# EAGLE design TERMINAL v2 (EAGLE 9.6.2)
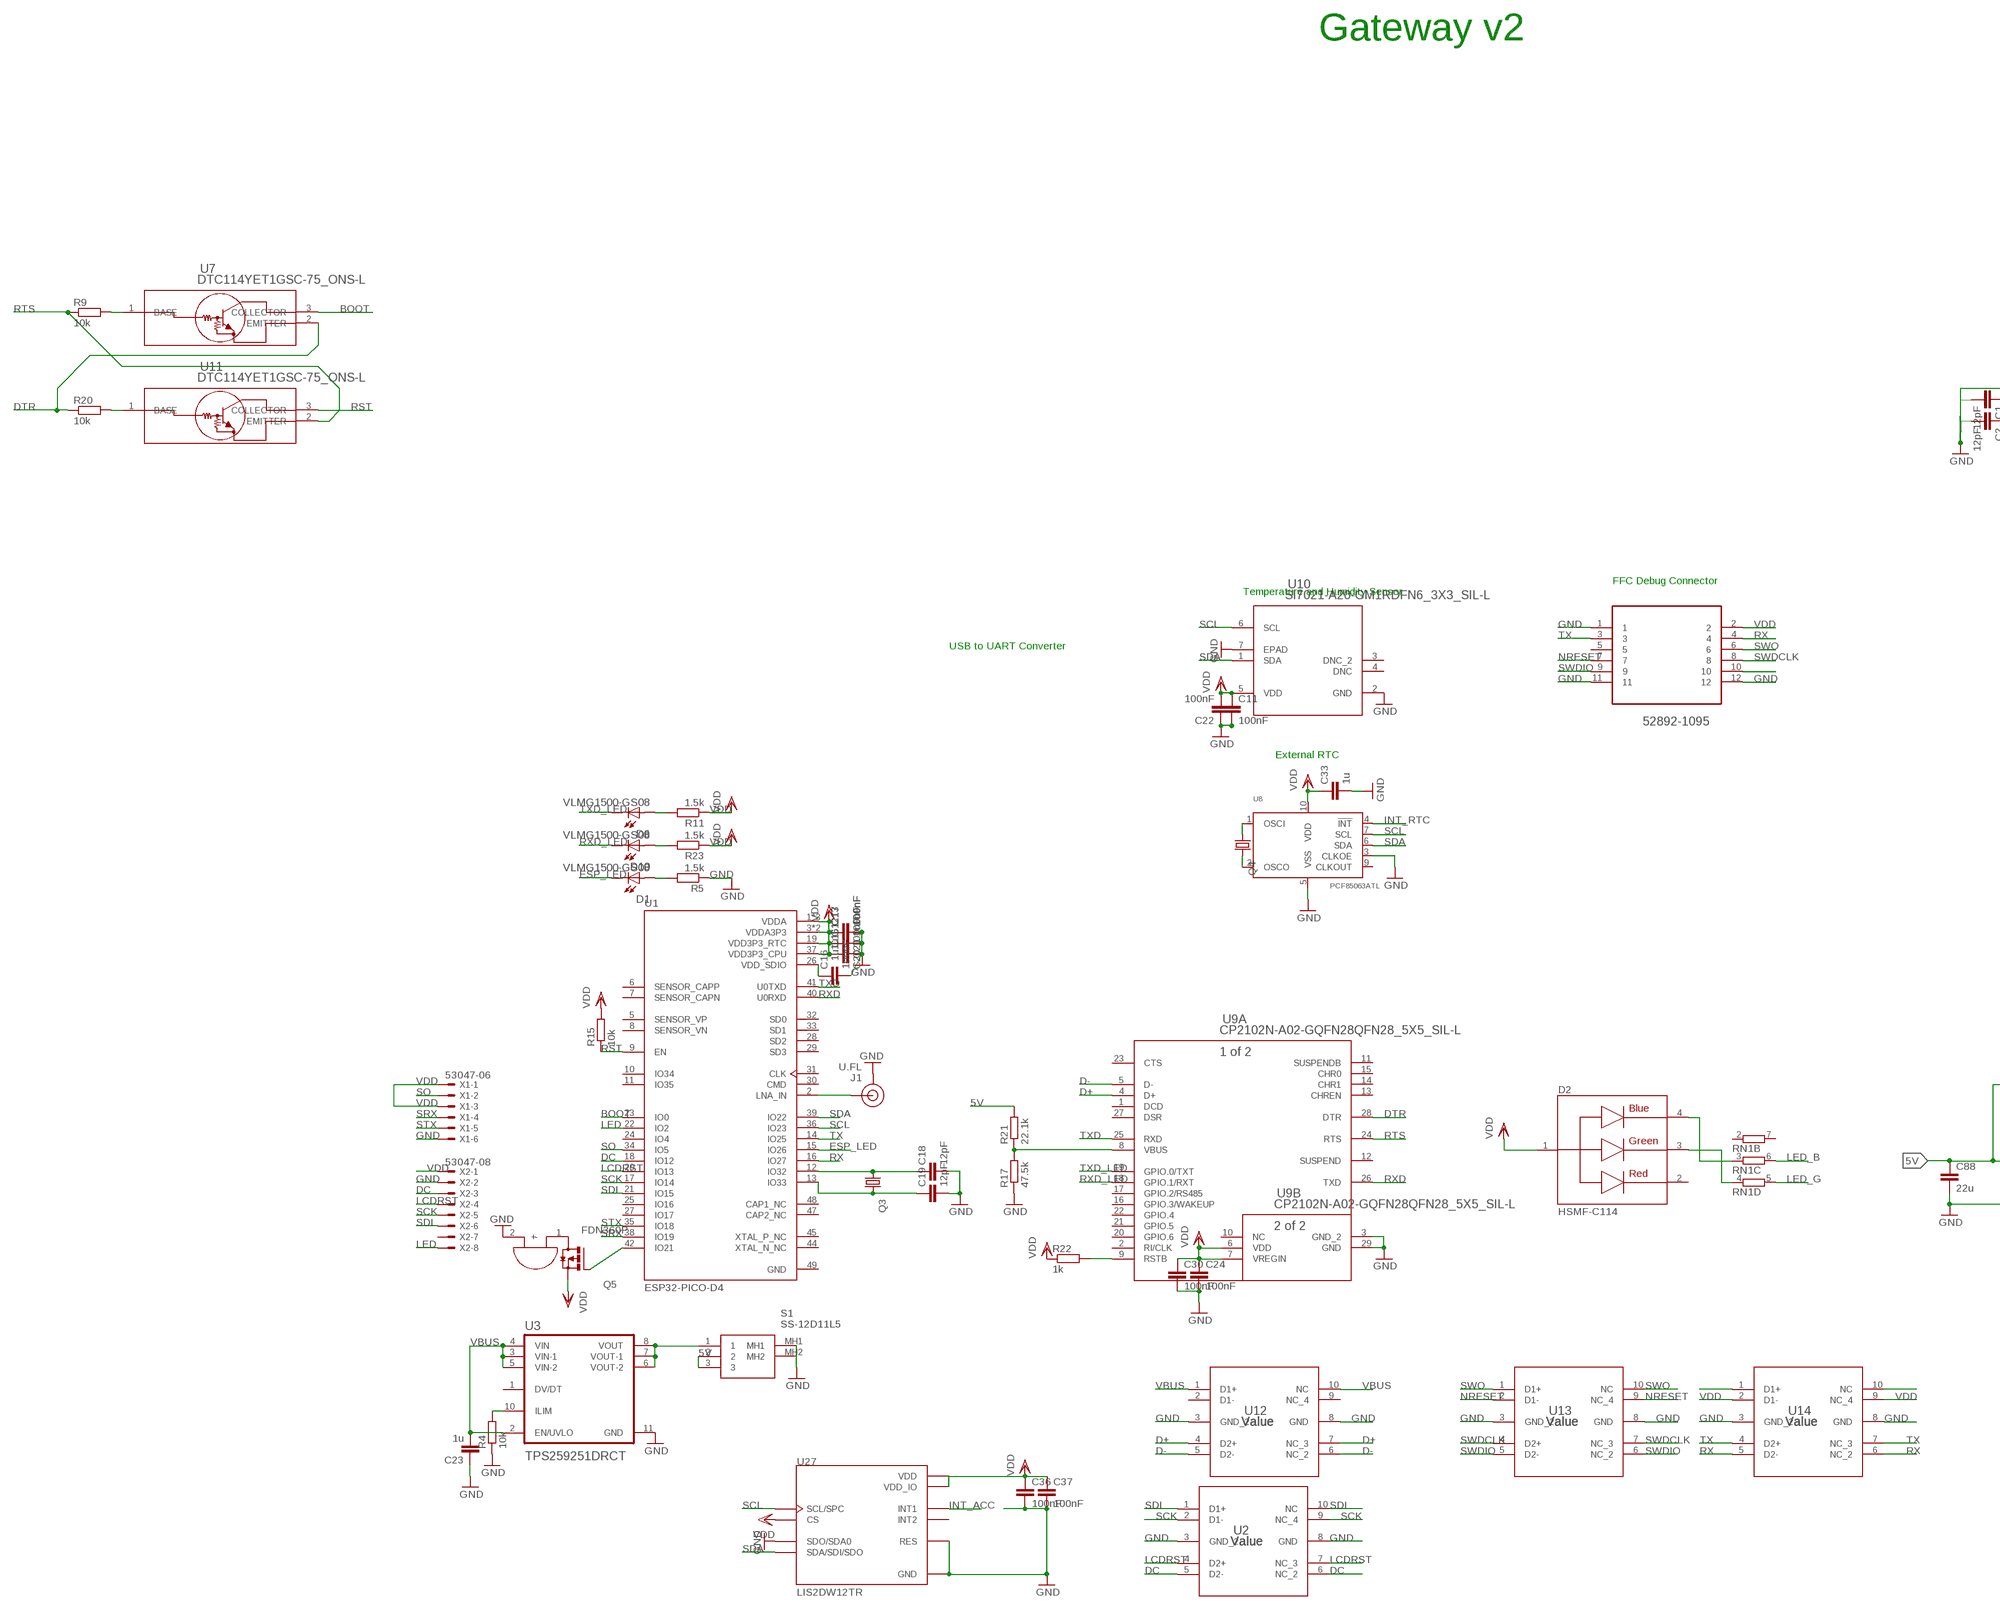
[diagram p0: schematic, sheet 1, part 1 of 2]
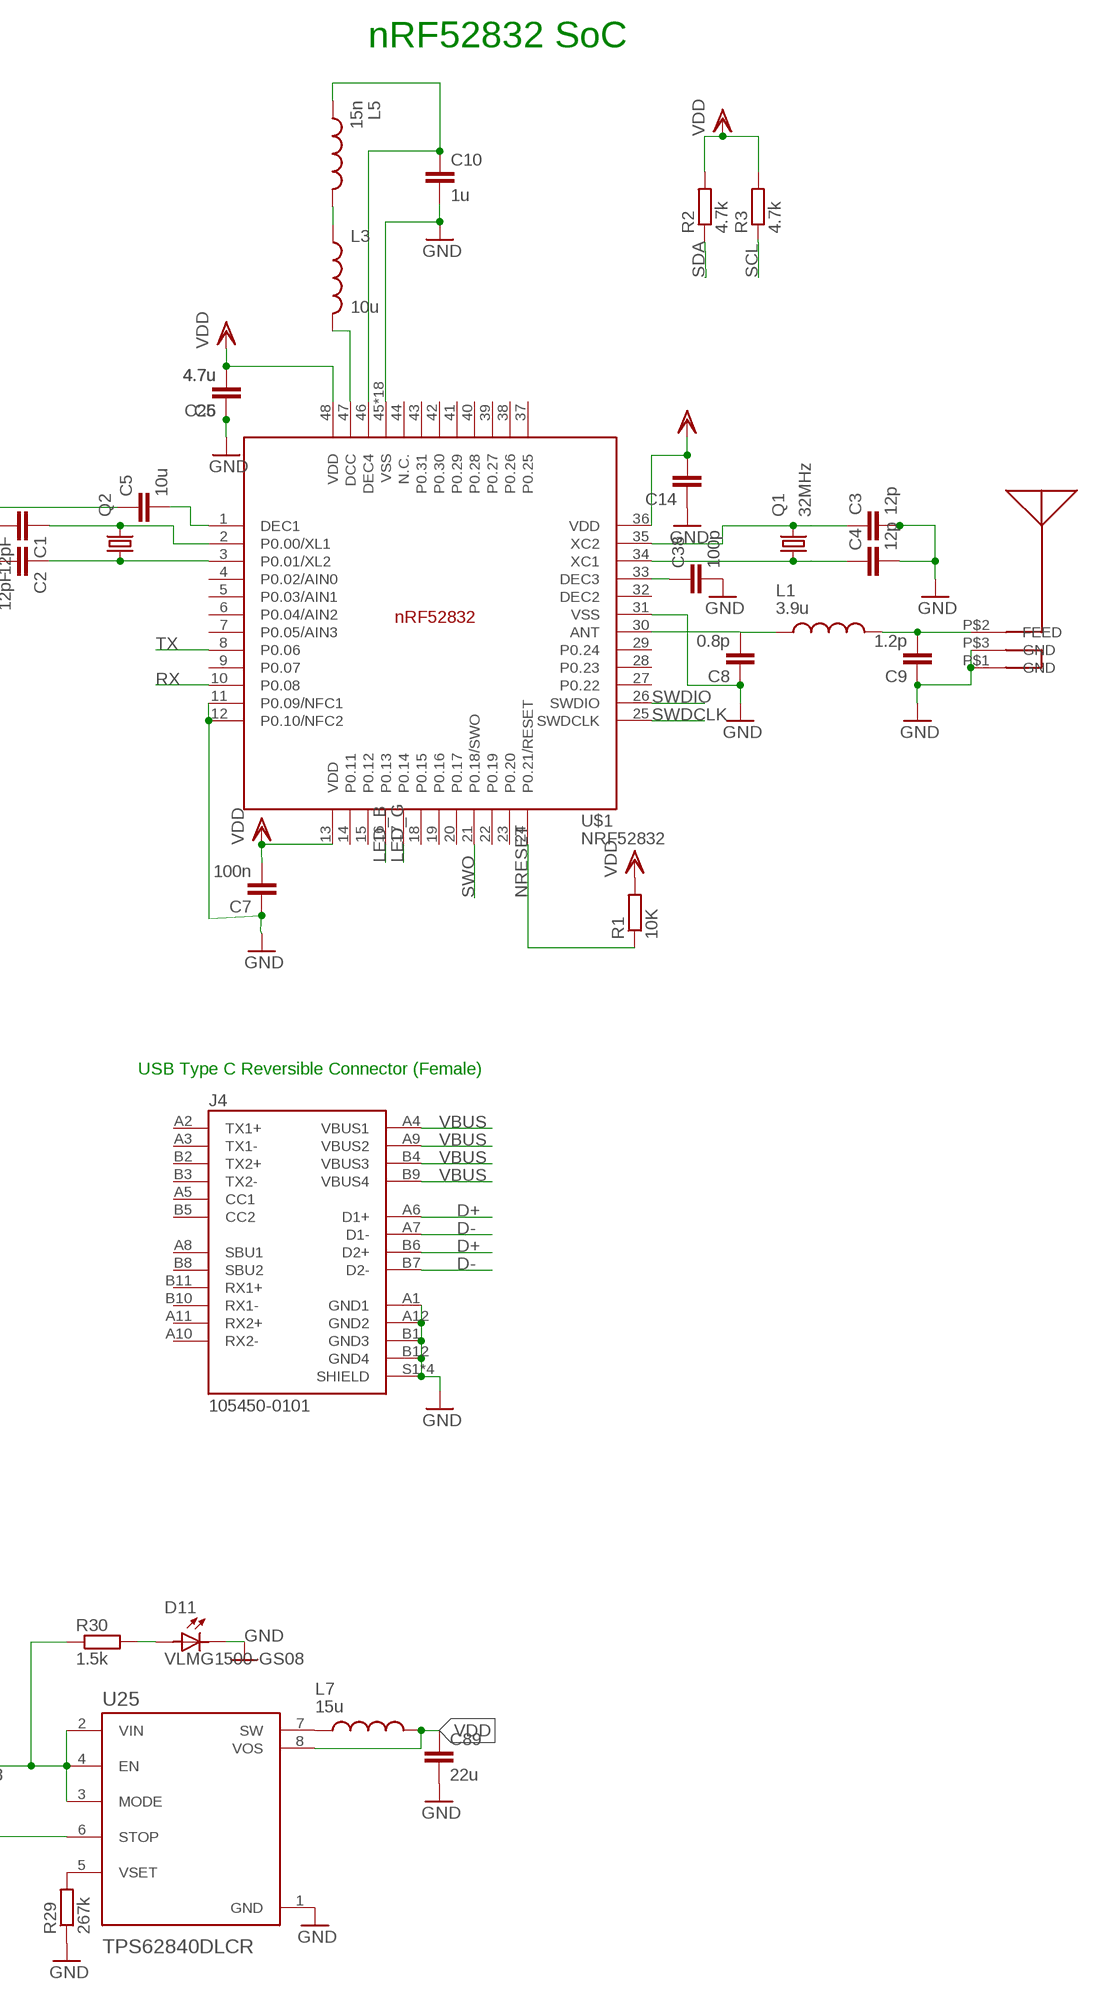
[diagram p1: schematic, sheet 1, part 2 of 2]

## Parts
C1  12pF  CC0402  [C0402]
C2  12pF  CC0402  [C0402]
C3  12p  CC0402  [C0402]
C4  12p  CC0402  [C0402]
C5  10u  CC0402  [C0402]
C6  4.7u  CC0402  [C0402]
C7  100n  CC0402  [C0402]
C8  0.8p  CC0402  [C0402]
C9  1.2p  CC0402  [C0402]
C10  1u  CC0402  [C0402]
C11  100nF  CC0402  [C0402]
C12  100nF  CC0402  [C0402]
C13  100nF  CC0402  [C0402]
C14  100u  CC0402  [C0402]
C15  100nF  CC0402  [C0402]
C16  100nF  CC0402  [C0402]
C17  100nF  CC0402  [C0402]
C18  12pF  CC0402  [C0402]
C19  12pF  CC0402  [C0402]
C20  1u  CC0603R  [C0603R]
C21  1u  CC0603R  [C0603R]
C22  100nF  CC0402  [C0402]
C23  1u  CC0603R  [C0603R]
C24  100nF  CC0402  [C0402]
C25  4.7u  CC0402  [C0402]
C30  100nF  CC0402  [C0402]
C33  1u  CC0603R  [C0603R]
C36  100nF  CC0402  [C0402]
C37  100nF  CC0402  [C0402]
C38  100p  CC0402  [C0402]
C88  22u  CC0603R  [C0603R]
C89  22u  CC0603R  [C0603R]
D1  VLMG1500-GS08  [LEDC1005X35N]
D2  HSMF-C114  [DIOSC160X150X35-4N]
D6  VLMG1500-GS08  [LEDC1005X35N]
D10  VLMG1500-GS08  [LEDC1005X35N]
D11  VLMG1500-GS08  [LEDC1005X35N]
J1  U.FL  U.FL2PIN  [U.FL]
J4  105450-0101  [MOLEX_105450-0101]
L1  3.9u  MHQ0402P7N5JT000  [INDC0402X26N]
L3  10u  INDUCTOR  [L0603]
L5  15n  MHQ0402P7N5JT000  [INDC0402X26N]
L7  15u  1277AS-H-1R5M=P2  [INDC3225X120N]
Q1  32MHz  KX-5  [2.0X1.6_KX-5]
Q2  KX-327-RT  [2.0X1.2]
Q3  KX-327-RT  [2.0X1.2]
Q4  KX-327-RT  [2.0X1.2]
Q5  FDN360P  [SUPER-SOT3]
R1  10K  RR0402  [R0402]
R2  4.7k  RR0402  [R0402]
R3  4.7k  RR0402  [R0402]
R4  10k  RR0402  [R0402]
R5  1.5k  RR0402  [R0402]
R9  10k  RR0402  [R0402]
R11  1.5k  RR0402  [R0402]
R15  10k  RR0402  [R0402]
R17  47.5k  RR0402  [R0402]
R20  10k  RR0402  [R0402]
R21  22.1k  RR0402  [R0402]
R22  1k  RR0402  [R0402]
R23  1.5k  RR0402  [R0402]
R29  267k  RR0402  [R0402]
R30  1.5k  RR0402  [R0402]
RN1  4R-N0402ARV341  [4X0402ARV341]
S1  SS-12D11L5  [SS12D11L5]
U1  ESP32-PICO-D4  [PQFN50P700X700X104-49N]
U2  Value  ESD204DQAR  [DQA0010A]
U3  TPS259251DRCT  [VREG_V62/16624-01YE]
U5  52892-1095  [MOLEX_52892-1095]
U7  DTC114YET1GSC-75_ONS-L  [SC-75_ONS-L]
U8  PCF85063ATL  [SOT1197-1]
U9  CP2102N-A02-GQFN28QFN28_5X5_SIL-L  [QFN28_5X5_SIL-L]
U10  SI7021-A20-GM1RDFN6_3X3_SIL-L  [DFN6_3X3_SIL-L]
U11  DTC114YET1GSC-75_ONS-L  [SC-75_ONS-L]
U12  Value  ESD204DQAR  [DQA0010A]
U13  Value  ESD204DQAR  [DQA0010A]
U14  Value  ESD204DQAR  [DQA0010A]
U25  TPS62840DLCR  [SON50P200X150X100-8N]
U27  LIS2DW12TR  [LGA12R50P4X4_200X200X70]
U$1  NRF52832  [QFN40P600X600X90-48_N]
U$2  SMD_BUZZER  [SMD_BUZZER]
U$4  CHIPANTENNAL2  [CHIPANTENNAL2]
X1  53047-06  [53047-06]
X2  53047-08  [53047-08]

## Nets
5V: C88.1 R21.2 R30.1 S1.2 S1.3 U25.2(VIN) U25.3(MODE) U25.4(EN)
BOOT: U1.23(IO0) U7.3(COLLECTOR)
D+: J4.A6(D1+) J4.B6(D2+) U9.4(A:D+) U12.4(D2+) U12.7(NC_3)
D-: J4.A7(D1-) J4.B7(D2-) U9.5(A:D-) U12.5(D2-) U12.6(NC_2)
DC: U1.18(IO12) U2.5(D2-) U2.6(NC_2) X2.3
DTR: R20.1 U7.2(EMITTER) U9.28(A:DTR)
ESP_LED: D1.2 U1.15(IO26)
GND: C1.2 C2.2 C3.2 C4.2 C5.1 C6.1 C7.1 C8.1 C9.1 C10.2 C11.2 C12.2 C13.2 C14.1 C15.2 C16.2 C17.2 C18.2 C19.2 C20.1 C21.1 C22.1 C23.1 C24.2 C25.1 C30.2 C33.2 C36.2 C37.2 C38.2 C88.2 C89.2 D11.2 J1.1(GND) J1.2(GND) J4.A1(GND1) J4.A12(GND2) J4.B1(GND3) J4.B12(GND4) J4.S1(SHIELD) J4.S2(SHIELD) J4.S3(SHIELD) J4.S4(SHIELD) R4.1 R5.1 R17.1 R29.1 S1.MH1 S1.MH2 U2.3(GND_2) U2.8(GND) U3.11(GND) U5.1 U5.11 U5.12 U8.3(CLKOE) U8.5(VSS) U9.3(B:GND_2) U9.29(B:GND) U10.2(GND) U10.7(EPAD) U12.3(GND_2) U12.8(GND) U13.3(GND_2) U13.8(GND) U14.3(GND_2) U14.8(GND) U25.1(GND) U25.6(STOP) U27.3(SDO/SDA0) U27.6(GND) U27.7(RES) U27.8(GND) U$1.11(P0.09/NFC1) U$1.12(P0.10/NFC2) U$1.31(VSS) U$1.45(VSS) U$1.PAD(VSS) U$1.PAD@VIA01(VSS) U$1.PAD@VIA02(VSS) U$1.PAD@VIA03(VSS) U$1.PAD@VIA04(VSS) U$1.PAD@VIA05(VSS) U$1.PAD@VIA06(VSS) U$1.PAD@VIA07(VSS) U$1.PAD@VIA08(VSS) U$1.PAD@VIA09(VSS) U$1.PAD@VIA10(VSS) U$1.PAD@VIA11(VSS) U$1.PAD@VIA12(VSS) U$1.PAD@VIA13(VSS) U$1.PAD@VIA14(VSS) U$1.PAD@VIA15(VSS) U$1.PAD@VIA16(VSS) U$2.2(-) U$4.P$1(GND) U$4.P$3(GND) X1.6 X2.2
INT_ACC: U27.12(INT1)
INT_RTC: U8.4(!INT!)
LCDRST: U1.20(IO13) U2.4(D2+) U2.7(NC_3) X2.4
LED: U1.22(IO2) X2.8
LED_B: RN1.6 U$1.16(P0.13)
LED_G: RN1.5 U$1.17(P0.14)
N$1: C1.1 Q2.2 U$1.2(P0.00/XL1)
N$2: C2.1 Q2.1 U$1.3(P0.01/XL2)
N$3: C3.1 Q1.3 U$1.35(XC2)
N$4: C4.1 Q1.1 U$1.34(XC1)
N$5: C5.2 U$1.1(DEC1)
N$6: C8.2 L1.1 U$1.30(ANT)
N$7: J1.FEED(SIGNAL) U1.2(LNA_IN)
N$8: C16.1 U1.26(VDD_SDIO)
N$9: L3.2 U$1.47(DCC)
N$10: L3.1 L5.2
N$11: C10.1 L5.1 U$1.46(DEC4)
N$12: C19.1 Q3.2 U1.13(IO33)
N$13: C18.1 Q3.1 U1.12(IO32)
N$14: Q5.3(D) U$2.1(+)
N$15: C38.1 U$1.33(DEC3)
N$16: Q5.1(G) U1.42(IO21)
N$17: S1.1 U3.6(VOUT-2) U3.7(VOUT-1) U3.8(VOUT)
N$18: D1.1 R5.2
N$20: R4.2 U3.10(ILIM)
N$21: U5.10
N$22: D2.3 RN1.4
N$23: R17.2 R21.1 U9.8(A:VBUS)
N$24: D2.4 RN1.3
N$29: R20.2 U11.1(BASE)
N$30: R9.2 U7.1(BASE)
N$33: Q4.1 U8.1(OSCI)
N$34: Q4.2 U8.2(OSCO)
N$35: R22.2 U9.9(A:RSTB)
N$36: D6.1 R11.2
N$37: D10.1 R23.2
N$47: U14.10(NC)
N$80: L7.1 U25.7(SW)
N$81: R29.2 U25.5(VSET)
N$84: D11.1 R30.2
NRESET: R1.1 U5.7 U13.2(D1-) U13.9(NC_4) U$1.24(P0.21/RESET)
RFP1: C9.2 L1.2 U$4.P$2(FEED)
RST: R15.1 U1.9(EN) U11.3(COLLECTOR)
RTS: R9.1 U9.24(A:RTS) U11.2(EMITTER)
RX: U1.16(IO27) U5.4 U14.5(D2-) U14.6(NC_2) U$1.10(P0.08)
RXD: U1.40(U0RXD) U9.26(A:TXD)
RXD_LED: D10.2 U9.18(A:GPIO.1/RXT)
SCK: U1.17(IO14) U2.2(D1-) U2.9(NC_4) X2.5
SCL: R3.1 U1.36(IO23) U8.7(SCL) U10.6(SCL) U27.1(SCL/SPC)
SDA: R2.1 U1.39(IO22) U8.6(SDA) U10.1(SDA) U27.4(SDA/SDI/SDO)
SDI: U1.21(IO15) U2.1(D1+) U2.10(NC) X2.6
SO: U1.34(IO5) X1.2
SRX: U1.38(IO19) X1.4
STX: U1.35(IO18) X1.5
SWDCLK: U5.8 U13.4(D2+) U13.7(NC_3) U$1.25(SWDCLK)
SWDCLK1: U14.1(D1+)
SWDIO: U5.9 U13.5(D2-) U13.6(NC_2) U$1.26(SWDIO)
SWO: U5.6 U13.1(D1+) U13.10(NC) U$1.21(P0.18/SWO)
TX: U1.14(IO25) U5.3 U14.4(D2+) U14.7(NC_3) U$1.8(P0.06)
TXD: U1.41(U0TXD) U9.25(A:RXD)
TXD_LED: D6.2 U9.19(A:GPIO.0/TXT)
VBUS: C23.2 J4.A4(VBUS1) J4.A9(VBUS2) J4.B4(VBUS3) J4.B9(VBUS4) U3.2(EN/UVLO) U3.3(VIN-1) U3.4(VIN) U3.5(VIN-2) U12.1(D1+) U12.10(NC)
VDD: C6.2 C7.2 C11.1 C12.1 C13.1 C14.2 C15.1 C17.1 C20.2 C21.2 C22.2 C24.1 C25.2 C30.1 C33.1 C36.1 C37.1 C89.1 D2.1 L7.2 Q5.2(S) R1.2 R2.2 R3.2 R11.1 R15.2 R22.1 R23.1 U1.1(VDDA) U1.3(VDDA3P3) U1.4(VDDA3P3) U1.19(VDD3P3_RTC) U1.37(VDD3P3_CPU) U1.43(VDDA) U1.46(VDDA) U5.2 U8.10(VDD) U9.6(B:VDD) U9.7(B:VREGIN) U10.5(VDD) U14.2(D1-) U14.9(NC_4) U25.8(VOS) U27.2(CS) U27.9(VDD) U27.10(VDD_IO) U$1.13(VDD) U$1.36(VDD) U$1.48(VDD) X1.1 X1.3 X2.1
Unconnected: D2.2 J4.A2(TX1+) J4.A3(TX1-) J4.A5(CC1) J4.A8(SBU1) J4.A10(RX2-) J4.A11(RX2+) J4.B2(TX2+) J4.B3(TX2-) J4.B5(CC2) J4.B8(SBU2) J4.B10(RX1-) J4.B11(RX1+) RN1.1 RN1.2 RN1.7 RN1.8 U1.5(SENSOR_VP) U1.6(SENSOR_CAPP) U1.7(SENSOR_CAPN) U1.8(SENSOR_VN) U1.10(IO34) U1.11(IO35) U1.24(IO4) U1.25(IO16) U1.27(IO17) U1.28(SD2) U1.29(SD3) U1.30(CMD) U1.31(CLK) U1.32(SD0) U1.33(SD1) U1.44(XTAL_N_NC) U1.45(XTAL_P_NC) U1.47(CAP2_NC) U1.48(CAP1_NC) U3.1(DV/DT) U5.5 U8.9(CLKOUT) U9.1(A:DCD) U9.2(A:RI/CLK) U9.10(B:NC) U9.11(A:SUSPENDB) U9.12(A:SUSPEND) U9.13(A:CHREN) U9.14(A:CHR1) U9.15(A:CHR0) U9.16(A:GPIO.3/WAKEUP) U9.17(A:GPIO.2/RS485) U9.20(A:GPIO.6) U9.21(A:GPIO.5) U9.22(A:GPIO.4) U9.23(A:CTS) U9.27(A:DSR) U10.3(DNC_2) U10.4(DNC) U12.2(D1-) U12.9(NC_4) U27.11(INT2) U$1.4(P0.02/AIN0) U$1.5(P0.03/AIN1) U$1.6(P0.04/AIN2) U$1.7(P0.05/AIN3) U$1.9(P0.07) U$1.14(P0.11) U$1.15(P0.12) U$1.18(P0.15) U$1.19(P0.16) U$1.20(P0.17) U$1.22(P0.19) U$1.23(P0.20) U$1.27(P0.22) U$1.28(P0.23) U$1.29(P0.24) U$1.32(DEC2) U$1.37(P0.25) U$1.38(P0.26) U$1.39(P0.27) U$1.40(P0.28) U$1.41(P0.29) U$1.42(P0.30) U$1.43(P0.31) U$1.44(N.C.) X2.7

## Notes on the sheet
- Gateway v2
- nRF52832 SoC
- FFC Debug Connector
- Temperature and Humidity Sensor
- USB to UART Converter
- USB Type C Reversible Connector (Female)
- External RTC

## Power pins joined to a net without a drawn wire
GND: U1.49(GND)

## Library data of the parts
C1-C19 C22 C24 C25 C30 C36-C38 = eagle-ltspice:C: CAPACITOR, European symbol; SPICEMODEL: NONE; SPICEPREFIX: C
C20 C21 C23 C33 C88 C89 = eagle-ltspice:C: CAPACITOR, European symbol
D1 D6 D10 D11 = VLMG1500-GS08:VLMG1500-GS08: 0402 GREEN 571nm 35MCD 65° Rectangle with Flat Top SMT LED; AVAILABILITY: Unavailable; DESCRIPTION: 0402 GREEN 571nm 35MCD 65° Rectangle with Flat Top SMT LED; MF: Vishay; MP: VLMG1500-GS08; PACKAGE: 0402 Vishay; PRICE: None
D2 = HSMF-C114:HSMF-C114: LED Tri-Color Blue/Green/Red 468nm/523nm/637nm 4-Pin Chip LED T/R; AVAILABILITY: Unavailable; DESCRIPTION: LED RGB DIFFUSED CHIP SMD; MF: Broadcom Limited; MP: HSMF-C114; PACKAGE: 0606 Broadcom; PRICE: None
J1 = SparkFun-Connectors:U.FL2PIN: SMD Antenna Connector - U.FL 2mm height, 3.0mm x 3.0mm receptacle size. SparkFun Products: SparkFun WiFi Shield - ESP8266 <https://www.sparkfun.com/products/13287> SparkFun ESP8266 Thing <https://www.sparkfun.com/products/13231> SparkFun MiniGen - Pro Mini Signal Generator Shield <https://www.sparkfun.com/products/11420>; PROD_ID: CONN-09193; SF_ID: WRL-09144
J4 = 105450-0101:105450-0101: USB Shielded I/O Receptacle; Type C; Right Angle; Surface Mount; Gold over Nickel; AVAILABILITY: Unavailable; DESCRIPTION: USB-C (USB TYPE-C) USB 3.1 (USB 3.1 Gen 2, Superspeed+) Receptacle Connector 24 Position Surface Mount, Right Angle; Through Hole; MF: Molex; MP: 1054500101; PACKAGE: None; PRICE: None
L1 L5 = MHQ0402P7N5JT000:MHQ0402P7N5JT000: 221 NH 5% GOLD TERMINAL; AVAILABILITY: Unavailable; DESCRIPTION: FIXED IND 7.5NH 200MA 1.2 OHM; MF: TDK; MP: MHQ0402P7N5JT000; PACKAGE: 0402 TDK; PRICE: None
L3 = BeagleBone_Blue_R3:INDUCTOR: Inductors Basic Inductor/Choke - 0603 and 1206. Footprints are not proven and vary greatly between part numbers. SRN6045- 33uH, 20% 1.4A
L7 = 1277AS-H-1R5M_P2:1277AS-H-1R5M=P2: Ind Metal Alloy Shielded 1.5uH 20% 1MHz Powdered Iron 2.6A 1210 T/R Check prices <https://pricing.snapeda.com/parts/1277AS-H-1R5M%3DP2/Murata/view-part?ref=eda>; AVAILABILITY: Warning; DESCRIPTION: Inductor with Inductance: 1.5uH Tol. +/-20%, Package: 1210 (3225); MF: Murata; MP: 1277AS-H-1R5M=P2; PACKAGE: 1210 Murata; PRICE: None; PURCHASE-URL: https://pricing.snapeda.com/search/part/1277AS-H-1R5M=P2/?ref=eda
Q1 = crystal-geyer_V1_0:KX: Quartz Crystals (MHz) SMD: KX - Serie Model Size l/w/h [mm] Frequency Range Frequency Stability Temp. Range [°C] Load Capacitance AECQ 200 availabel Datasheet KX-4 KX-5 KX-6 KX-7 KX-9A KX-9B KX-12A KX-12B KX-13 KX-20 KX-K KX-KS 1.6/1.2/0.3 2.0/1.6/0.45 2.5/2.0/0.55 3.2/2.5/0.8 5.0/3.2/1.0 5.0/3.2/1.1 6.0/3.5/1.1 6.0/3.5/1.0 7.0/5.0 /1.3 11.6/5.5/1.6 12.3/4.5/4.2 12.3/4.5/3.2 24.0 ~ 80.0 MHz 16.0 ~ 80.0 MHz 12.0 ~ 80.0 MHz 8.0 ~ 60.0 MHz 7,68 ~ 300,0 MHz 8,0 ~ 50,0 MHz 8,0 ~ 150,0 MHz 8,0 ~ 50,0 MHz 6,0 ~ 160,0 MHz 3,579 ~ 25,0 MHz 3,579 ~ 70,0 MHz 3,579 ~ 70,0 MHz ±10 … ±50ppm ±10 … ±50ppm ±10 … ±50ppm ±10 … ±50ppm ±10 … ±50ppm ±10 … ±50ppm ±10 … ±50ppm ±10 … ±50ppm ±10 … ±50ppm ±50ppm ±10 … ±50ppm ±10 … ±50ppm (*) -40°C …+85°C (*) -40°C …+125°C (*) -40°C …+125°C (*) -40°C …+125°C (*) -40°C …+105°C (*) -40°C …+105°C (*) -40°C …+125°C (*) -40°C …+105°C (*) -40°C …+105°C (*) -40°C …+105°C (*) -40°C …+85°C (*) -40°C …+85°C 8, 8…16 8, 8…16 10, 8…16 12, 7…20 16, 10…20 16, 10…20 16, 10…20 16, 12…20 16, 12…20 16, 12…20 16, 12…30 16, 12…30 - yes yes yes - - - - - - - - KX-4.pdf <http://www.geyer-electronic.de/uploads/tx_userartikelfrequenz/GEYER-KX-4.pdf> KX-5.pdf <http://www.geyer-electronic.de/uploads/tx_userartikelfrequenz/GEYER-KX-5.pdf> KX-6.pdf <http://www.geyer-electronic.de/uploads/tx_userartikelfrequenz/GEYER-KX-6.pdf> KX-7.pdf <http://www.geyer-electronic.de/uploads/tx_userartikelfrequenz/GEYER-KX-7.pdf> KX-9A.pdf <http://www.geyer-electronic.de/uploads/tx_userartikelfrequenz/GEYER-KX-9A.pdf> KX-9B.pdf <http://www.geyer-electronic.de/uploads/tx_userartikelfrequenz/GEYER-KX-9B.pdf> KX-12A.pdf <http://www.geyer-electronic.de/uploads/tx_userartikelfrequenz/GEYER-KX-12A.pdf> KX-12B.pdf <http://www.geyer-electronic.de/uploads/tx_userartikelfrequenz/GEYER-KX-12B.pdf> KX-13.pdf <http://www.geyer-electronic.de/uploads/tx_userartikelfrequenz/GEYER-KX-13.pdf> KX-20.pdf <http://www.geyer-electronic.de/uploads/tx_userartikelfrequenz/GEYER-KX-20.pdf> KX-K.pdf <http://www.geyer-electronic.de/uploads/tx_userartikelfrequenz/GEYER-KX-K.pdf> KX-KS.pdf <http://www.geyer-electronic.de/uploads/tx_userartikelfrequenz/GEYER-KX-KS.pdf> <http://www.geyer-electronic.de/fileadmin/template/img/logo-geyer-electronic.png> Details see: http://www.geyer-electronic.de/Frequenz-Produkte.9.0.html Created 2016-06-07, Hans Locher 2016 (C) Geyer Quartz Technology KX4,KX5,KX6,KX7,KX9A,KX9B,KX12A,KX12B,KX13,KX20,KXK,KXKS;1612;2016;2520;3225;5032;6035;7050;11655;12345;1,6x1,2;2,0x1,6;2,5x2,0;3,2x2,5;5,0x3,2;6,0x3,5;7,0x5,0;11,6x5,5;12,3x4,5;12,3x4,5;1.6x1.2;2.0x1.6;2.5x2.0;3.2x2.5;5.0x3.2;6.0x3.5;7.0x5.0;11.6x5.5;12.3x4.5;12.3x4.5;
Q2-Q4 = crystal-geyer_V1_0:KX-327: Tuning Fork Crystals (kHz) SMD: KX327 - Serie Model Size l/w/h [mm] Frequency Range Frequency Stability Temp. Range [°C] Load Capacitance AECQ 200 availabel Datasheet KX-327VT KX-327FT KX-327RT KX-327NHT KX-327NHF KX-327L KX-327S 1.25/1.05/0.5 1.6/1.0/0.5 2.0/1.2/0.6 3.2/1.5/0.8 3.2/1.5/0.8 7.0/1.5/1.4 8.2/3.8/2.5 32,768 kHz 32,768 kHz 32,768 kHz 32,768 kHz 32,768 kHz 32,768 kHz 32,768 kHz ±10 … ±20ppm ±10 … ±20ppm ±10 … ±20ppm ±10 … ±20ppm ±10 … ±20ppm ±10 … ±20ppm ±5 … ±20ppm (*) -40°C …+85°C (*) -40°C …+85°C (*) -40°C …+85°C (*) -40°C …+85°C (*) -40°C …+125°C (*) -40°C …+85°C (*) -40°C …+85°C 7/9/12,5 7/9/12,5 7/9/12,6 7/9/12,5 9/12,5 7/9/12,5 6/12,5 - - - - yes - - KX-327VT.pdf <http://www.geyer-electronic.de/uploads/tx_userartikelfrequenz/GEYER-KX-327VT.pdf> KX-327FT.pdf <http://www.geyer-electronic.de/uploads/tx_userartikelfrequenz/GEYER-KX-327FT.pdf> KX-327RT.pdf <http://www.geyer-electronic.de/uploads/tx_userartikelfrequenz/GEYER-KX-327RT.pdf> KX-327NHT.pdf <http://www.geyer-electronic.de/uploads/tx_userartikelfrequenz/GEYER-KX-327NHT.pdf> KX-327NHF.pdf <http://www.geyer-electronic.de/uploads/tx_userartikelfrequenz/GEYER-KX-327NHF.pdf> KX-327L.pdf <http://www.geyer-electronic.de/uploads/tx_userartikelfrequenz/GEYER-KX-327L.pdf> KX-327S.pdf <http://www.geyer-electronic.de/uploads/tx_userartikelfrequenz/GEYER-KX-327S.pdf> <http://www.geyer-electronic.de/fileadmin/template/img/logo-geyer-electronic.png> Details see: http://www.geyer-electronic.de/Frequenz-Produkte.9.0.html Created 2016-06-07, Hans Locher 2016 (C) Geyer Quartz Technology KX327VT,KX327FT,KX327RT,KX327NHT,KX327NHF,KX327S,KX327L;125105;1610;2012;3215;7015;8238;1,25x1,05,1.25x1.05;1,6x1,0,1.6x1.0;2,0x1,2,2.0x1.2;3,2x1,5,3.2x1.5;8,2x3,8,8.2x3.8,7.0x1.5,7,0x1,532.768kHz
Q5 = transistor-power:FDN360P: Single P-Channel, PowerTrench (R) MOSFET Source: http://www.fairchildsemi.com/ds/FD/FDN360P.pdf
R1-R5 R9 R11 R15 R17 R20-R23 R29 R30 = eagle-ltspice:R: RESISTOR, European symbol; SPICEMODEL: NONE; SPICEPREFIX: R
RN1 = resistor-dil:4R-N: Array Chip Resistor Source: RS Component / Phycomp; OC_FARNELL: unknown; OC_NEWARK: unknown
S1 = SS-12D11L5:SS-12D11L5: Toggle Switches DIP RoHS Source: Datasheet <https://datasheet.lcsc.com/szlcsc/XKB-SS-12D11L5_C319010.pdf>; ARROW_PART_NUMBER: SS-12D11L5; DESCRIPTION: Toggle Switches DIP RoHS; HEIGHT: 6.9mm; MANUFACTURER_NAME: XKB Enterprise; MANUFACTURER_PART_NUMBER: SS-12D11L5
U1 = ESP32-PICO-D4:ESP32-PICO-D4: Bluetooth, WiFi 802.11b/g/n, Bluetooth v4.2 +EDR, Class 1, 2 and 3 Transceiver Module 2.4GHz ~ 2.5GHz Surface Mount Check prices <https://pricing.snapeda.com/parts/ESP32-PICO-D4/Espressif%20Systems/view-part?ref=eda>; AVAILABILITY: In Stock; DESCRIPTION: Bluetooth, WiFi 802.11b/g/n, Bluetooth v4.2 +EDR, Class 1, 2 and 3 Transceiver Module 2.4GHz ~ 2.5GHz Surface Mount; MF: Espressif Systems; MP: ESP32-PICO-D4; PACKAGE: SMD-48 Espressif Systems; PRICE: None
U2 U12-U14 = ESD204DQAR:ESD204DQAR; MANUFACTURER: Texas Instruments; PARTNUMBER: ESD204DQAR; REFDES: RefDes; TYPE: TYPE
U3 = TPS259251DRCT:TPS259251DRCT: Check prices <https://pricing.snapeda.com/parts/TPS259251DRCT/Texas%20Instruments/view-part?ref=eda>; AVAILABILITY: Warning; DESCRIPTION: 4.5-V-5.5-V, 30m?, 2-5A eFuse 10-VSON -40 to 85; MF: Texas Instruments; MP: TPS259251DRCT; PACKAGE: VSON-10 Texas Instruments; PRICE: None; PURCHASE-URL: https://pricing.snapeda.com/search/part/TPS259251DRCT/?ref=eda
U5 = 52892-1095:52892-1095: CONNECTOR, FPC, ZIF, 0.50MM, 10 WAY; AVAILABILITY: Unavailable; DESCRIPTION: Socket, r/a, Fpc, Zif, Smt, 10way; MF: Molex; MP: 52892-1095; PACKAGE: None; PRICE: None
U7 U11 = DTC114YET1G:DTC114YET1G; BUILT_BY: EMA_Justin; COPYRIGHT: Copyright (C) 2018 Accelerated Designs. All rights reserved; DATASHEET: https://www.onsemi.com/pub/Collateral/DTC114Y-D.PDF; MANUFACTURER_PART_NUMBER: DTC114YET1G; SOURCELIBRARY: ON_Semiconductor_2020-01-13; VENDOR: ON Semiconductor
U8 = PCF85063ATL:PCF85063ATL: Tiny Real-Time Clock/calendar with alarm function and I2C-bus The PCF85063A is a CMOS1 Real-Time Clock (RTC) and calendar optimized for low power consumption. An offset register allows fine-tuning of the clock. All addresses and data are transferred serially via the two-line bidirectional I2C-bus. Maximum data rate is 400 kbit/s. The register address is incremented automatically after each written or read data byte. AAL Eindhoven MK; AVAILABILITY: Unavailable; DESCRIPTION: Real Time Clock _RTC_ IC Clock/Calendar I²C, 2-Wire Serial 10-XFDFN Exposed Pad; MF: NXP USA; MP: PCF85063ATL; PACKAGE: DFN-10 NXP Semiconductors; PRICE: None
U9 = CP2102N:CP2102N-A02-GQFN28; BUILT_BY: EMA_Cory; COPYRIGHT: Copyright (C) 2018 Accelerated Designs. All rights reserved; DATASHEET: https://www.silabs.com/documents/public/data-sheets/cp2102n-datasheet.pdf; MANUFACTURER_PART_NUMBER: CP2102N-A02-GQFN28; SOURCELIBRARY: Silicon_Labs_2020-02-14; VENDOR: Silicon Labs
U10 = SI7021:SI7021-A20-GM1R; BUILT_BY: EMA_Jessica; COPYRIGHT: Copyright (C) 2018 Accelerated Designs. All rights reserved; MANUFACTURER_PART_NUMBER: SI7021-A20-GM1R; SOURCELIBRARY: Silicon_Labs_2020-01-01; VENDOR: Silicon Labs
U25 = TPS62840DLCR:TPS62840DLCR: None Check prices <https://snapeda.com/parts/TPS62840DLCR/Texas%20Instruments/view-part/?ref=eda> Check prices <https://pricing.snapeda.com/parts/TPS62840DLCR/Texas%20Instruments/view-part?ref=eda>; AVAILABILITY: Warning; DESCRIPTION: 60-nA IQ, 1.8-V to 6.5-VIN, high-efficiency 750-mA step-down converter 8-VSON-HR -40 to 125; MF: Texas Instruments; MP: TPS62840DLCR; PACKAGE: VSON-HR-8 Texas Instruments; PRICE: None; PURCHASE-URL: https://pricing.snapeda.com/search/part/TPS62840DLCR/?ref=eda
U27 = LIS2DW12TR:LIS2DW12TR: Mems Digital Output Motion Sensor Check prices <https://pricing.snapeda.com/parts/LIS2DW12TR/STMicroelectronics/view-part?ref=eda>; AVAILABILITY: Good; DESCRIPTION: Accelerometer X, Y, Z Axis ±2g, 4g, 8g, 16g 400Hz 12-LGA (2x2); MF: STMicroelectronics; MP: LIS2DW12TR; PACKAGE: LGA-12 STMicroelectronics; PRICE: None; PURCHASE-URL: https://pricing.snapeda.com/search/part/LIS2DW12TR/?ref=eda
U$1 = Nordic_nRF:NRF52832: nRF52832 Features Single chip, highly flexible, 2.4 GHz multi-protocol SoC 32-bit ARM Cortex-M4F Processor 1.7v to 3.6v operation 512kB flash + 64kB RAM Supports concurrent Bluetooth Smart/ANT protocol operation On-chip NFC tag for Out-of-Band (OOB) pairing Up to +4dBm output power -96dBm sensitivity, Bluetooth Smart Thread safe and run-time protected Event driven API On air compatible with nRF24L and nRF24AP series 2 data rates (2Mbps/1Mbps) PPI - maximum flexibility for power-efficient applications and code simplification Automated power management system with automatic power management of each peripheral Configurable I/O mapping for analog and digital I/O 3 x Master/Slave SPI 2 x Two-wire interface (I²C) UART (RTS/CTS) 3 x PWM AES HW encryption Real Time Counter (RTC) Digital microphone interface (PDM) On-chip balun Applications Internet of Things (IoT) Wearables SmartHome sensors Connected white goods Computer peripherals Voice-command smart remotes A4WP ‘Rezence’ wireless charging Beacons Sports and fitness sensors and hubs Connected health products Smart watches RC Toys Interactive games Building automation and sensor networks
U$2 = SMD_BUZZER:SMD_BUZZER
U$4 = CHIPANTENNA:CHIPANTENNAL2
X1 = con-molex:53?-06: CONNECTOR wire to board 1.25 mm (.049 inch) pitch header; MF: MOLEX; MPN: 53047-0610-C; OC_FARNELL: 9733078; OC_NEWARK: 03M2965
X2 = con-molex:53?-08: CONNECTOR wire to board 1.25 mm (.049 inch) pitch header; MF: MOLEX; MPN: 53047-0810; OC_FARNELL: 1012258; OC_NEWARK: 98K9826

## Board
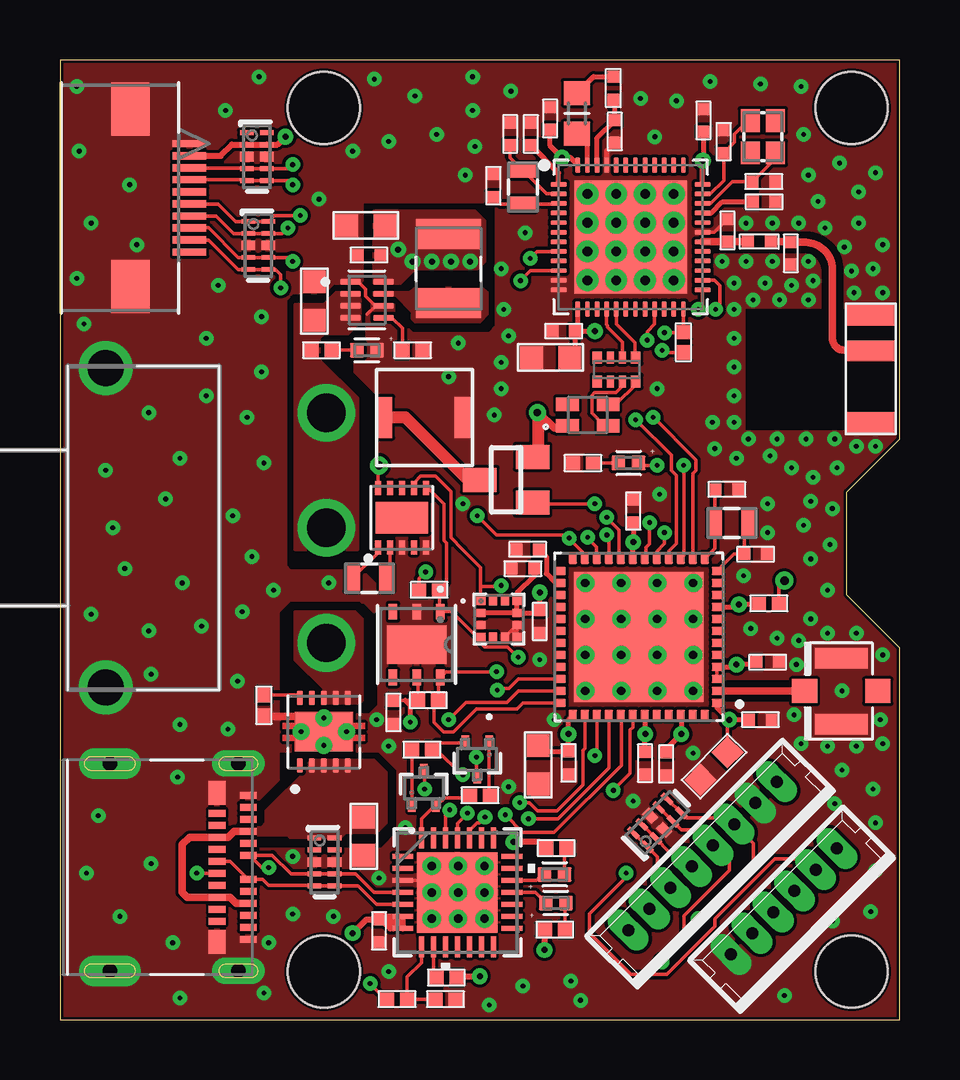
[diagram p2: board, top side]
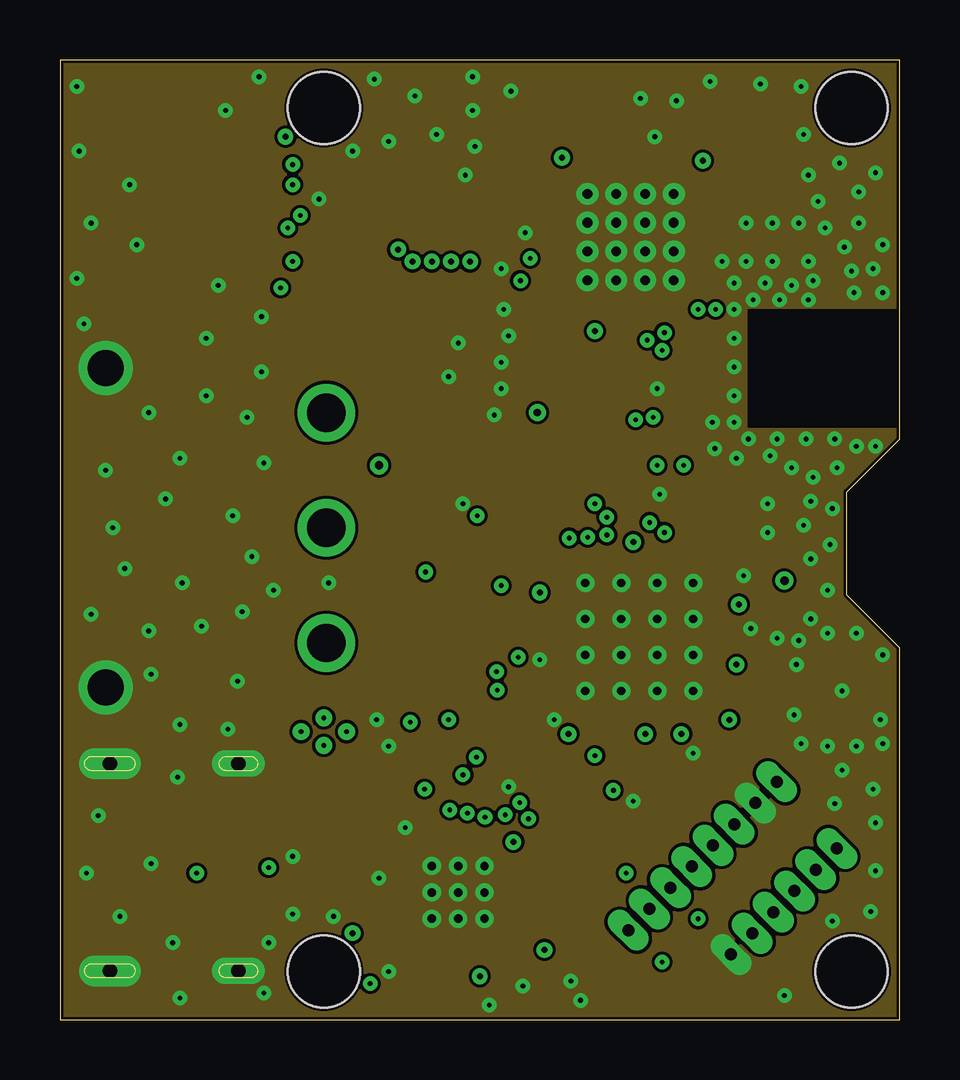
[diagram p3: board, inner layer Route2]
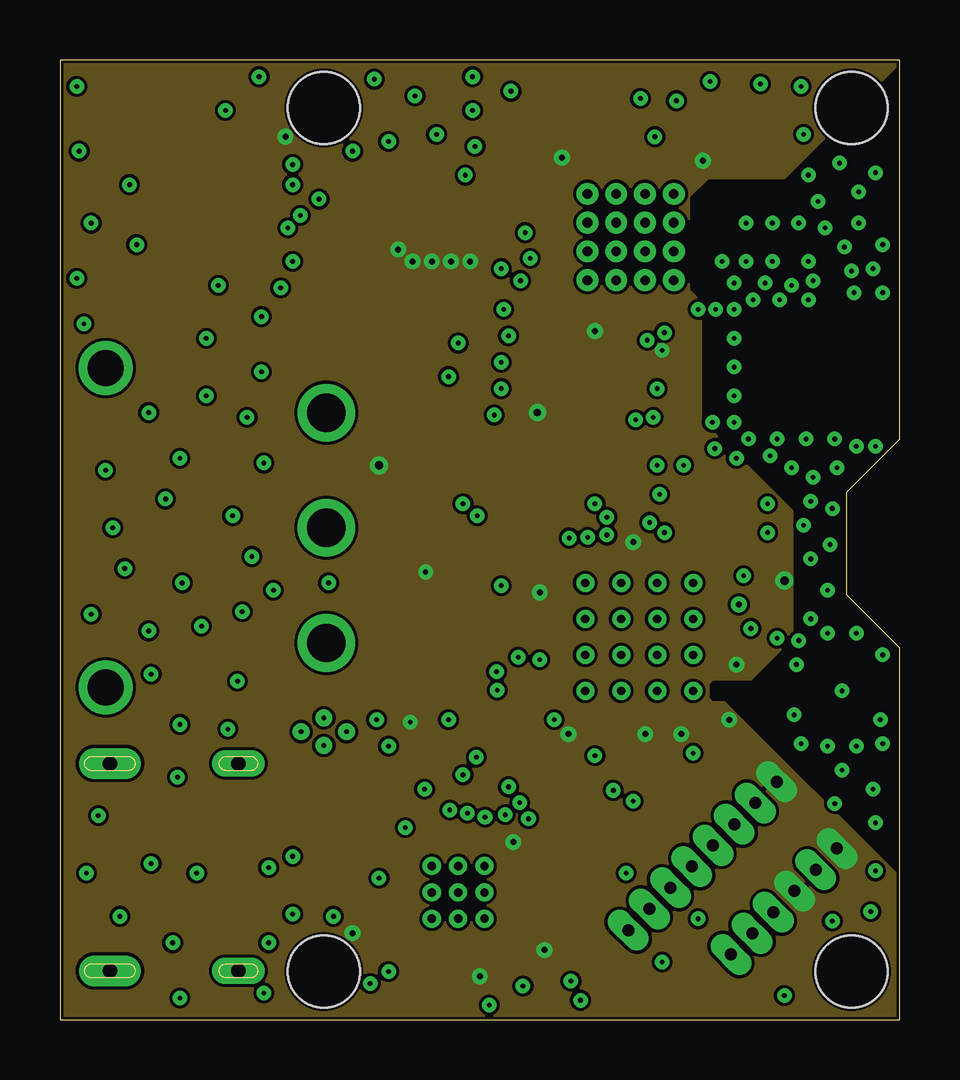
[diagram p4: board, inner layer Route15]
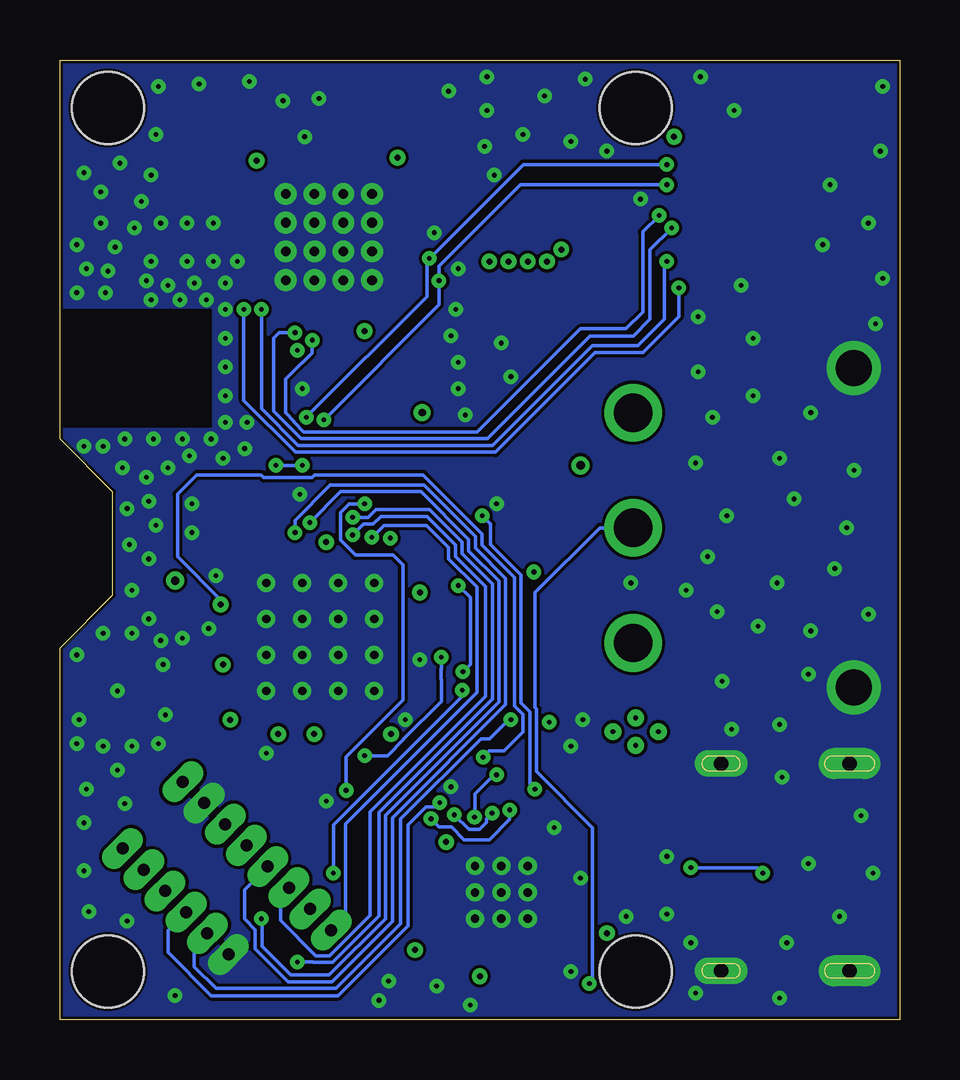
[diagram p5: board, bottom side, seen from below]

Size 35 x 40 mm. Coordinates in mm from the lower left corner, seen from the top.
Outline: 0,0 35,0 35,15.5 32.8,17.7 32.8,22 35,24.2 35,40 0,40 0,0
Copper layers (1+2*15+16): Top 0.035mm / dielectric 1.5mm / Route2 0.035mm / dielectric 0.15mm / Route15 0.035mm / dielectric 0.2mm / Bottom 0.035mm
Design rules "default *": minimum track width 5mil, minimum drill 0.2mm, track to track 5mil, track to pad 5mil, pad to pad 5mil, via to via 5mil, smd to smd 5mil, copper to edge 5mil, drill to drill 6mil, minimum pad ring 10mil, minimum via ring 8mil, stop-mask expansion 0mil, vias tented up to drill 40mil, thermal gap 0mil
Holes 3 mm at 33,2 33,38 11,38 11,2
tRestrict: 10 lines

### Footprints (pad centres in the part's own frame; a part is rotated, then mirrored left to right if it is on the bottom)
C0402 = smd 0.5 x 0.5: 1 -0.475,0; 2 0.475,0
C0603R = smd 0.95 x 0.95: 1 -0.85,0; 2 0.75,0
LEDC1005X35N = smd 0.59 x 0.61: 1 -0.415,0; 2 0.415,0
DIOSC160X150X35-4N = smd 0.94 x 0.57: 1 -0.845,-0.45; 2 -0.845,0.45; 3 0.845,0.45; 4 0.845,-0.45
U.FL = smd 2.2 x 0.85: 1 0,1.375; 2 0,-1.375 | smd 1.05 x 1: FEED 1.525,0; NC -1.525,0
MOLEX_105450-0101 = smd 0.3 x 0.7: A1 -3,3.77; A2 -2.5,3.77; A3 -2,3.77; A4 -1.5,3.77; A5 -1,3.77; A6 -0.5,3.77; A7 0.5,3.77; A8 1,3.77; A9 1.5,3.77; A10 2,3.77; A11 2.5,3.77; A12 3,3.77; B2 2.25,2.47; B3 1.75,2.47; B4 1.25,2.47; B5 0.75,2.47; B6 0.25,2.47; B7 -0.25,2.47; B8 -0.75,2.47; B9 -1.25,2.47; B10 -1.75,2.47; B11 -2.25,2.47 | smd 1 x 0.7: B1 3.1,2.47; B12 -3.1,2.47 | drill 0.6 pad 1.1 long: S1 -4.32,3.36; S2 4.32,3.36 | drill 0.6 pad 1.3 long: S3 -4.32,-2; S4 4.32,-2
INDC0402X26N = smd 0.5 x 0.5: 1 -0.732,0; 2 0.232,0
L0603 = smd 1 x 1.1: 1 -0.85,0; 2 0.85,0
INDC3225X120N = smd 1.24 x 2.72: 1 -1.44,0; 2 1.44,0
2.0X1.6_KX-5 = smd 0.95 x 0.8: 1 -0.675,-0.525; 2 0.675,-0.525; 3 0.675,0.525; 4 -0.675,0.525
2.0X1.2 = smd 0.6 x 1.1: 1 -0.7,0; 2 0.7,0
SUPER-SOT3 = smd 1 x 1.4: 1 -0.95,-1.1; 2 0.95,-1.1; 3 0,1.1
R0402 = smd 0.6 x 0.55: 1 -0.425,0; 2 0.425,0
4X0402ARV341 = smd 0.4 x 0.5: 1 -0.8,-0.5; 4 0.8,-0.5; 5 0.8,0.5; 8 -0.8,0.5 | smd 0.3 x 0.5: 2 -0.25,-0.5; 3 0.25,-0.5; 6 0.25,0.5; 7 -0.25,0.5
SS12D11L5 = drill 1.6 pad 2.4: 1 0,0; 2 4.8,0; 3 9.6,0 | drill 1.5 pad 2.25: MH1 -1.85,9.2; MH2 11.45,9.2
PQFN50P700X700X104-49N = smd 0.45 x 0.35: 1 -3.265,2.75; 2 -3.265,2.25; 3 -3.265,1.75; 4 -3.265,1.25; 5 -3.265,0.75; 6 -3.265,0.25; 7 -3.265,-0.25; 8 -3.265,-0.75; 9 -3.265,-1.25; 10 -3.265,-1.75; 11 -3.265,-2.25; 12 -3.265,-2.75; 25 3.265,-2.75; 26 3.265,-2.25; 27 3.265,-1.75; 28 3.265,-1.25; 29 3.265,-0.75; 30 3.265,-0.25; 31 3.265,0.25; 32 3.265,0.75; 33 3.265,1.25; 34 3.265,1.75; 35 3.265,2.25; 36 3.265,2.75 | smd 0.35 x 0.45: 13 -2.75,-3.265; 14 -2.25,-3.265; 15 -1.75,-3.265; 16 -1.25,-3.265; 17 -0.75,-3.265; 18 -0.25,-3.265; 19 0.25,-3.265; 20 0.75,-3.265; 21 1.25,-3.265; 22 1.75,-3.265; 23 2.25,-3.265; 24 2.75,-3.265; 37 2.75,3.265; 38 2.25,3.265; 39 1.75,3.265; 40 1.25,3.265; 41 0.75,3.265; 42 0.25,3.265; 43 -0.25,3.265; 44 -0.75,3.265; 45 -1.25,3.265; 46 -1.75,3.265; 47 -2.25,3.265; 48 -2.75,3.265 | smd 5.4 x 5.4: 49 0,0
DQA0010A = smd 0.565 x 0.2: 1 -0.417,1; 2 -0.417,0.5; 4 -0.417,-0.5; 5 -0.417,-1; 6 0.417,-1; 7 0.417,-0.5; 9 0.417,0.5; 10 0.417,1 | smd 0.565 x 0.4: 3 -0.417,0; 8 0.417,0
VREG_V62/16624-01YE = smd 0.6 x 0.24: 1 -1.4,1; 2 -1.4,0.5; 3 -1.4,0; 4 -1.4,-0.5; 5 -1.4,-1; 6 1.4,-1; 7 1.4,-0.5; 8 1.4,0; 9 1.4,0.5; 10 1.4,1 | smd 1.65 x 2.4: 11 0,0 | drill 0.2 pad 0.3: 12 0,-0.95; 13 -0.575,0; 14 0.575,0; 15 0,0.95
MOLEX_52892-1095 = smd 0.305 x 1.397: 1 2.261,2.896; 2 1.753,2.896; 3 1.245,2.896; 4 0.762,2.896; 5 0.254,2.896; 6 -0.254,2.896; 7 -0.762,2.896; 8 -1.245,2.896; 9 -1.753,2.896; 10 -2.261,2.896 | smd 2.21 x 1.6: 11 -3.702,5.359; 12 3.702,5.359
SC-75_ONS-L = smd 0.305 x 0.61: 1 -0.5,-0.699; 2 0.5,-0.699; 3 0,0.699
SOT1197-1 = smd 0.25 x 0.575: 1 -1,-1.238; 2 -0.5,-1.238; 3 0,-1.238; 4 0.5,-1.238; 5 1,-1.238; 6 1,1.238; 7 0.5,1.238; 8 0,1.238; 9 -0.5,1.238; 10 -1,1.238 | smd 2.2 x 1.3: CP 0,0
QFN28_5X5_SIL-L = smd 0.864 x 0.203: 1 -2.273,1.5; 2 -2.273,1; 3 -2.273,0.5; 4 -2.273,0; 5 -2.273,-0.5; 6 -2.273,-1; 7 -2.273,-1.5; 15 2.273,-1.5; 16 2.273,-1; 17 2.273,-0.5; 18 2.273,0; 19 2.273,0.5; 20 2.273,1; 21 2.273,1.5 | smd 0.203 x 0.864: 8 -1.5,-2.273; 9 -1,-2.273; 10 -0.5,-2.273; 11 0,-2.273; 12 0.5,-2.273; 13 1,-2.273; 14 1.5,-2.273; 22 1.5,2.273; 23 1,2.273; 24 0.5,2.273; 25 0,2.273; 26 -0.5,2.273; 27 -1,2.273; 28 -1.5,2.273 | smd 3.353 x 3.353: 29 0,0
DFN6_3X3_SIL-L = smd 0.66 x 0.356: 1 -1.372,0.991; 2 -1.372,0; 3 -1.372,-0.991; 4 1.372,-0.991; 5 1.372,0; 6 1.372,0.991 | smd 1.6 x 2.489: 7 0,0
SON50P200X150X100-8N = smd 0.86 x 0.27: 1 -0.685,0.75; 2 -0.685,0.25; 3 -0.685,-0.25; 4 -0.685,-0.75; 5 0.685,-0.75; 6 0.685,-0.25; 7 0.685,0.25; 8 0.685,0.75
LGA12R50P4X4_200X200X70 = smd 0.4 x 0.35: 1 -0.76,0.75; 2 -0.76,0.25; 3 -0.76,-0.25; 4 -0.76,-0.75; 7 0.76,-0.75; 8 0.76,-0.25; 9 0.76,0.25; 10 0.76,0.75 | smd 0.35 x 0.4: 5 -0.25,-0.76; 6 0.25,-0.76; 11 0.25,0.76; 12 -0.25,0.76
QFN40P600X600X90-48_N = smd 0.65 x 0.2: 1 -3,2.2; 2 -3,1.8; 3 -3,1.4; 4 -3,1; 5 -3,0.6; 6 -3,0.2; 7 -3,-0.2; 8 -3,-0.6; 9 -3,-1; 10 -3,-1.4; 11 -3,-1.8; 12 -3,-2.2; 25 3,-2.2; 26 3,-1.8; 27 3,-1.4; 28 3,-1; 29 3,-0.6; 30 3,-0.2; 31 3,0.2; 32 3,0.6; 33 3,1; 34 3,1.4; 35 3,1.8; 36 3,2.2 | smd 0.2 x 0.65: 13 -2.2,-3; 14 -1.8,-3; 15 -1.4,-3; 16 -1,-3; 17 -0.6,-3; 18 -0.2,-3; 19 0.2,-3; 20 0.6,-3; 21 1,-3; 22 1.4,-3; 23 1.8,-3; 24 2.2,-3; 37 2.2,3; 38 1.8,3; 39 1.4,3; 40 1,3; 41 0.6,3; 42 0.2,3; 43 -0.2,3; 44 -0.6,3; 45 -1,3; 46 -1.4,3; 47 -1.8,3; 48 -2.2,3 | smd 4.7 x 4.7: PAD 0,0 | drill 0.4: PAD@VIA01 -1.8,1.8; PAD@VIA02 -1.8,0.6; PAD@VIA03 -1.8,-0.6; PAD@VIA04 -1.8,-1.8; PAD@VIA05 -0.6,1.8; PAD@VIA06 -0.6,0.6; PAD@VIA07 -0.6,-0.6; PAD@VIA08 -0.6,-1.8; PAD@VIA09 0.6,1.8; PAD@VIA10 0.6,0.6; PAD@VIA11 0.6,-0.6; PAD@VIA12 0.6,-1.8; PAD@VIA13 1.8,1.8; PAD@VIA14 1.8,0.6; PAD@VIA15 1.8,-0.6; PAD@VIA16 1.8,-1.8
SMD_BUZZER = smd 0.7 x 1.7: 1 0,0; 2 3.3,0
CHIPANTENNAL2 = smd 0.85 x 2: P$1 0.45,1; P$2 1.925,1; P$3 4.9,1
53047-06 = drill 0.5 pad 0.698 long: 1 3.125,0.45; 2 1.875,0.45; 3 0.625,0.45; 4 -0.625,0.45; 5 -1.875,0.45; 6 -3.125,0.45
53047-08 = drill 0.5 pad 0.698 long: 1 4.375,0.45; 2 3.125,0.45; 3 1.875,0.45; 4 0.625,0.45; 5 -0.625,0.45; 6 -1.875,0.45; 7 -3.125,0.45; 8 -4.375,0.45

### Placement (x,y rotation side)
C1  18.77,36.92 90 top
C2  18.07,34.76 90 top
C3  27.67,36.6 90 top
C4  29.34,34.93 0 top
C5  19.63,36.92 270 top
C6  26.83,37.48 270 top
C7  25.27,10.66 90 top
C8  27.83,32.9 270 top
C9  30.47,31.94 90 top
C10  23.13,37.02 270 top
C11  12.88,31.87 180 top
C12  29.5,14.9 0 top
C13  23.9,21.2 90 top
C14  20.43,37.56 270 top
C15  21.2,10.7 270 top
C16  19.5,19.6 180 top
C17  29.2,12.5 0 top
C18  29,19.4 0 top
C19  27.8,22.1 0 top
C20  27.3,10.6 45 top
C21  20.5,27.6 0 top
C22  13.9,12.8 90 top
C23  12.66,7.69 90 top
C24  13.3,3.7 270 top
C25  21,28.7 0 top
C30  24.39,10.69 270 top
C33  19.94,10.57 270 top
C36  19.3,18.8 180 top
C37  20,16.6 270 top
C38  29.35,34.09 0 top
C88  10.6,30 90 top
C89  12.7,33.1 180 top
D1  23.7,23.2 0 top
D2  22,25.2 0 top
D6  20.62,6.05 180 top
D10  20.67,4.86 180 top
D11  12.8,27.9 0 top
J1  32.57,13.69 180 top
J4  4.08,6.35 270 top
L1  29.4,32.43 0 top
L3  21.55,37.77 270 top
L5  23.07,39.08 90 top
L7  16.2,31.3 90 top
Q1  29.3,36.8 90 top
Q2  19.3,34.7 90 top
Q3  28,20.7 180 top
Q4  12.9,18.4 0 top
Q5  18.6,22.5 90 top
R1  25.99,28.23 270 top
R2  15.39,17.91 180 top
R3  15.35,13.31 180 top
R4  8.5,13.1 90 top
R5  21.8,23.2 0 top
R9  15.09,11.25 180 top
R11  20.69,7.15 0 top
R15  29.55,17.35 0 top
R17  16.07,0.85 180 top
R20  17.51,9.35 0 top
R21  14.05,0.85 180 top
R22  16.11,1.75 180 top
R23  20.63,3.75 0 top
R29  14.7,27.9 180 top
R30  10.9,27.9 0 top
RN1  23.2,27.1 0 top
S1  11.11,15.7 90 top
U1  24.13,15.95 180 top
U2  24.9,8.2 135 top
U3  11,12 90 top
U5  8.3,34.25 90 top
U7  15.17,9.66 0 top
U8  14.25,20.92 0 top
U9  16.57,5.3 0 top
U10  14.87,15.63 270 top
U11  17.39,10.84 180 top
U12  11.03,6.57 0 top
U13  8.27,32.27 0 top
U14  8.21,35.97 0 top
U25  12.8,30 0 top
U27  18.3,16.7 0 top
U$1  23.79,32.62 0 top
U$2  13.5,25.1 0 top
U$4  32.8,29.8 270 top
X1  30.5,4.6 45 top
X2  27.1,6.5 45 top

### Tracks (layer width: path | path; a pad name or v marks a point on that pad's centre or on a via)
5V  (via drill 0.2)
  Top 0.152: R21.2 13.58,0.85 v12.93,1.5
  Bottom 0.152: v12.93,1.5 12.79,1.64 12.79,7.99 15.13,10.34 15.13,12.94 15.2,13.01 15.2,17.8 12.5,20.5 S1.2
  pour Top: 12.4,19.6 12.4,25.9 10.8,27.5 10.8,28.4 11,28.6 12,28.6 12.5,29.1 12.5,30.3 11.5,30.3 11,29.8 9.8,29.8 9.8,19.6
BOOT  (via drill 0.2)
  Top 0.15: U7.3 15.2,10.33 v15.2,9.6 | v21.23,20.07 21.23,20.02 21.88,19.38 U1.23
  Top 0.152: v17.4,21 18.19,20.21 21.1,20.21 v21.23,20.07
  Bottom 0.152: v17.4,21 17.05,20.65 17.05,19.81 15.78,18.54 15.78,13.19 15.41,12.82 15.41,9.82 v15.2,9.61 v15.2,9.6
D+  (via drill 0.2)
  Top 0.15: J4.B6 v5.7,6.1 | v8.7,6.33 8.42,6.33 7.9,6.85
  Top 0.152: J4.A6 7.9,6.85 8.85,6.85 9.63,6.07 U12.4 U12.7 12.33,6.07 13.1,5.3 U9.4
  Bottom 0.15: v5.7,6.1 5.93,6.33 v8.7,6.33
D-
  Top 0.15: J4.B7 7.1,6.6 J4.A7
  Top 0.152: J4.A7 8.45,5.85 8.7,5.6 10.58,5.6 U12.5 U12.6 12.43,5.57 13.2,4.8 U9.5
DC  (via drill 0.2)
  Top 0.15: U1.18 24.43,19.27 24.43,19.67 24.58,19.82 v24.58,20.72 | v26.6,4.2 26.7,4.2 28.9,6.4 28.9,7.35 X2.3 27.85,8.4 26.11,8.4 U2.5 U2.6
  Bottom 0.15: v26.6,4.2 26.58,4.18 26.58,3.06 25.38,1.85 23.77,1.85 21.42,4.21 21.42,8.52 16.7,13.24 16.7,18.28 17.96,19.54 17.96,20.02 19.95,22 23.29,22 v24.58,20.72
DTR
  Top 0.152: U9.28 15.07,8.36 U7.2 15.76,8.96 16.04,9.24 16.98,9.24 R20.1
ESP_LED  (via drill 0.2)
  Top 0.15: v26,23.1 26,19.34 U1.15
  Top 0.152: D1.2 24.21,23.1 v24.9,23.1
  Bottom 0.152: v24.9,23.1 v26,23.1
GND  (via drill 0.2, 0.35)
  Top 0.15: 18.8,16.2 U27.8 U27.7 19.06,16.04 18.91,16.2 | 18.91,16.2 18.8,16.2 | U27.6 18.8,16.2
  Top 0.152: U9.3 16.3,5.8 16.4,5.9 17,5.3 | U$1.31 27.27,32.82 C8.1 | U25.1 12.45,30.75 12.75,30.45 12.75,30.15 13.15,29.75 U25.6 13.15,29.75 12.8,29.4 | U9.29 17,5.3 | 17,5.3 17.55,4.75 | 10.7,12 10.61,12 | U1.49 24.13,15.93 v23.4,15.2
  Top 0.2: U8.5 15.25,19.51 | R4.1 9.93,12.68 10.03,12.58 8.59,12.58 R4.1 | R4.1 10.32,12.68 U3.11 10.7,12
  Top 0.203: C10.2 22.79,36.2 U$1.45
  other vias: 8.9,17.9 17.7,6.4 16.6,6.4 15.5,6.4 15.5,5.3 16.6,5.3 17.7,5.3 15.5,4.2 16.6,4.2 17.7,4.2 21.9,18.2 23.4,18.2 24.9,18.2 26.4,18.2 26.4,16.7 24.9,16.7 23.4,16.7 21.9,16.7 21.9,15.2 24.9,15.2 26.4,15.2 21.9,13.7 23.4,13.7 24.9,13.7 26.4,13.7 28.1,26 28.7,24.2 29.9,24.2 31.1,24.2 32.3,24.2 28.1,27.2 28.9,30 30,30 31.2,30 33.1,30.3 33,31.2 32.7,32.2 34.3,32.3 33.3,33.2 31.6,34.1 30.5,30.6 33.9,31.3 27.2,24.9 31.9,33 30.8,33.2 33.2,23.9 27.6,31.6 28.1,30.7 28.1,24.9 28.1,28.4 28.1,29.6 34.3,30.3 29.7,33.2 31.4,30.8 31.2,31.6 29.7,31.6 33.3,34.5 32.2,21.3 31.4,22.6 28.2,23.4 34,23.9 28.6,33.2 28.6,31.6 29.4,30.7 32.1,19.8 32.4,23 30.5,23 31.3,21.6 27.3,23.8 29.5,21.5 29.6,23.5 31,20.6 29.5,20.3 24.9,26.3 18.4,27.4 33.2,16.1 17.3,36.4 18.8,38.7 17.2,39.3 19.4,32.8 30.7,14.8 29.9,15.9 30.9,11.5 30.8,15.8 32,16.1 32,17.9 31.3,19.2 28.8,16.3 28.5,18.5 31.3,16.7 30.6,12.7 18.4,26.3 16.6,28.2 18.5,29.6 18.7,28.5 25,21.9 32.6,13.7 15.7,36.9 14.8,38.5 17.2,37.9 32,11.4 33.2,11.4 34.3,11.5 34.2,12.5 34.3,15.2 13.2,12.5 3.8,14.4 2.2,20.5 7,12.1 1.1,6.1 3.8,6.5 5.1,18.2 5,12.3 2.7,18.8 27.1,39.1 18.4,31.3 24.8,36.8 24.2,38.4 30.9,38.9 11.2,18.2 4.4,21.7 1.6,8.5 4.9,10.1 5,0.9 8.5,1.1 33.8,4.5 32.6,10.4 33.9,9.6 32.3,9 8.7,3.2 17.9,0.6 19.3,1.4 13.7,2 30.2,1 16.9,35.2 25.7,38.3 31.2,35.2 34,35.3 3.7,16.2 8,19.3 13.7,11.4 5.9,16.4 4.7,3.2 2.5,4.3 34,6.2 34,8.2 9.7,4.4 13.3,5.9 9.7,6.8 11.4,4.3 21.7,0.8 13.1,39.2 10.8,34.2 0.7,30.9 0.8,36.2 3.2,32.3 1.9,22.9 18.1,25.2 8.4,27 8.4,29.3 20.6,12.5 7.4,14.1 12.2,36.2 31,36.9 13.7,36.6 0.7,38.9 6.1,28.4 3.7,25.3 8.3,39.3 2.9,34.8 6.9,37.9 1.3,33.2 6.6,30.6 18.7,9.7 7.8,25.1 1,29 14.4,8 7.2,21 5,23.4 7.6,17 1.3,16.9 16.2,26.8 32.5,35.7 29.2,39 8.5,23.2 6.1,26 26.4,11.1 20,15 16.8,21.5 32.2,4.1 23.9,9.1 21.3,1.6
  pour Top: 35,0 0,0 0,7.1 13.4,7.1 14.1,7.8 14.1,10.4 13.3,11.2 8.2,11.2 8.2,12.9 8.9,12.9 9.1,12.7 12.9,12.7 13.3,13.1 13.3,26 12.3,27 12.3,27.8 12.8,28.3 12.8,29.4 13,29.6 13,29.8 13.9,29.8 13.9,29.4 14.7,28.6 17.9,28.6 18.2,28.9 18.2,33.8 17.9,34.1 10,34.1 10,40 34.9,40 34.9,29.7 28.5,29.7 28.5,24.5 34.9,24.5 35,24.4 35,24.1 32.8,21.9 32.8,17.7 35,15.5
  pour Top: 0,40 10.1,40 10.1,36.9 12.6,34.4 12.6,30.8 12.5,30.7 11.4,30.7 11,30.3 9.7,30.3 9.4,30 9.4,18.9 9.6,18.7 12.6,18.7 13.2,18.1 13.2,17.1 13.1,17 12.7,17.4 12.6,17.4 12.5,17.5 9.6,17.5 9.1,17 9.1,10 5.8,6.7 -0.1,6.7 -0.1,39.9
  pour Route2: 0,40 35,40 35,29.7 28.6,29.7 28.6,24.6 35,24.6 35,24.2 32.8,22 32.8,17.7 35,15.5 35,0 0,0
  pour Bottom: 0,40 35,40 35,29.7 28.6,29.7 28.6,24.6 35,24.6 35,24.2 32.8,22 32.8,17.7 35,15.5 35,0 0,0
LCDRST  (via drill 0.2)
  Top 0.15: v22.8,20.93 22.8,20.91 23.3,20.41 23.3,19.29 U1.20 | U2.7 U2.4 25.91,7.9 26.58,7.9 X2.4
  Top 0.152: v25.1,2.4 26,3.3 26,4.32 27.9,6.22 27.9,6.58 X2.4
  Bottom 0.15: 16.98,14.4 16.98,18.16 18.24,19.43 18.24,19.9 19.59,21.25 21.83,21.25 22.15,20.93 v22.8,20.93
  Bottom 0.152: v25.1,2.4 24.47,2.4 24.45,2.38 23.64,2.38 21.7,4.32 21.7,8.63 16.98,13.36 16.98,14.4
LED  (via drill 0.2)
  Top 0.15: U1.22 22.36,19.24 22.36,19.7 22,20.05 v22,20.1
  Bottom 0.15: X2.8 23.09,4.33 23.09,8.16 17.62,13.63 17.62,18.02 18.79,19.2 18.79,19.68 19.72,20.6 21.5,20.6 v22,20.1
LED_B
  Top 0.15: RN1.6 23.45,28.25 22.83,28.87 22.83,28.92 22.79,28.96 U$1.16
LED_G
  Top 0.15: U$1.17 23.2,29 23.97,28.23 23.97,27.63 RN1.5
N$1
  Top 0.152: U$1.2 20.28,34.42 Q2.2 18.77,35.93 C1.1
N$2
  Top 0.152: U$1.3 20.77,34 Q2.1 18.36,34 C2.1
N$3
  Top 0.152: Q1.3 28.7,37.48 28.12,36.9 28.12,36.58 C3.1 27.67,34.97 27.12,34.42 U$1.35
N$4
  Top 0.152: U$1.34 27.12,34.02 28.03,34.93 C4.1 29.82,35.89 Q1.1
N$5
  Top 0.203: U$1.1 20.79,35.28 C5.2
N$6
  Top 0.305: U$1.30 C8.2 L1.1
N$7
  Top 0.305: J1.FEED 27.41,13.69 U1.2
N$8
  Top 0.203: U1.26 20.66,18.2 20.27,18.59 20.27,19.3 C16.1
N$9
  Top 0.203: U$1.47 21.99,36.48 L3.2
N$10
  Top 0.203: L3.1 22.24,39.31 L5.2
N$11
  Top 0.203: U$1.46 22.39,36.76 C10.1 23.13,38.29 L5.1
N$12
  Top 0.152: U1.13 27.3,19.64 Q3.2 27.3,22.07 C19.1
N$13
  Top 0.152: U1.12 28.09,19.4 C18.1 28.52,20.52 Q3.1
N$14
  Top 0.508: U$2.1 14.4,25.1 17,22.5 Q5.3
N$15
  Top 0.203: C38.1 27.62,34.09 27.15,33.62 U$1.33
N$16  (via drill 0.2)
  Top 0.152: U1.42 23.88,12.19 23.76,12.06 23.76,10.26 23.07,9.57 v23.07,9.55 | Q5.1 19.75,21.5 v22.3,21.5
  Bottom 0.152: v23.07,9.55 23.07,10.95 20.7,13.32 20.7,18.95 21.11,19.36 22.68,19.36 23.31,19.99 23.31,21.14 22.95,21.5 v22.3,21.5
N$17
  pour Top: 11,13.2 12.5,13.2 12.6,13.3 12.6,16.7 12.3,17 9.8,17 9.8,15 11,13.8
N$18
  Top 0.152: R5.2 D1.1
N$20
  Top 0.152: R4.2 9.88,13.53 U3.10
N$22
  Top 0.15: RN1.4 24,26.47 23.19,25.65 D2.3
N$23
  Top 0.15: R17.2 R21.1 14.47,1.77 15.07,2.37 U9.8
N$24
  Top 0.15: RN1.3 23.4,26.55 23.4,26.37 23.17,26.14 22.29,26.14 22.17,26.02 22.17,25.28 22.7,24.75 D2.4
N$29
  Top 0.152: U11.1 17.89,9.39 R20.2
N$30
  Top 0.152: U7.1 R9.2
N$33
  Top 0.152: Q4.1 13.25,19.45 U8.1
N$34
  Top 0.152: U8.2 13.75,18.55 Q4.2
N$35
  Top 0.15: U9.9 15.57,1.86 R22.2
N$36
  Top 0.15: D6.1 21.04,7.07 R11.2
N$37
  Top 0.15: R23.2 21.05,4.83 D10.1
N$80
  pour Top: 13.1,30.3 14.6,30.3 14.8,30.5 17.6,30.5 17.8,30.3 17.8,29.4 17.5,29.1 14.8,29.1 14.7,29.2 14.7,29.5 14,30.2 13.1,30.2
N$81
  Top 0.152: R29.2 14.28,28.82 13.85,29.25 U25.5
N$84
  Top 0.152: R30.2 D11.1
NRESET  (via drill 0.2)
  Top 0.15: U5.7 6.51,33.49 7.23,32.77 U13.2 U13.9
  Top 0.152: U$1.24 R1.1 25.97,28.63 v25.2,28.63 | U13.9 9.27,32.77 v9.5,33
  Bottom 0.152: v9.5,33 10.4,32.1 10.4,29.2 11.1,28.5 12.9,28.5 17.19,24.21 24.95,24.21 26.1,25.36 26.1,28.4 25.87,28.63 v25.2,28.63
RFP1
  Top 0.305: L1.2 30.45,32.43 C9.2 31.1,32.4 arc-92 32.2,31.2 32.2,28.4 arc90 32.7,27.9 arc-3 U$4.P$2
RST  (via drill 0.2, 0.25)
  Top 0.15: U11.3 17.36,10.17 v17.36,10.94
  Top 0.203: U1.9 28.2,17.2 v28.3,17.3 29.07,17.3 R15.1
  Bottom 0.15: 30.1,21.9 30.1,19.3 28.3,17.5 v28.3,17.3
  Bottom 0.152: v17.36,10.94 17.11,11.19 16.49,11.19 15.69,11.99 15.69,12.71 16.06,13.07 16.06,18.42 17.41,19.77 17.41,20.25 19.86,22.7 24.38,22.7 24.49,22.59 26.51,22.59 26.62,22.7 29.3,22.7 30.1,21.9
RTS  (via drill 0.2)
  Top 0.152: U11.2 15.69,11.54 15.52,11.36 R9.1 15.7,11.25 16.75,10.2 v16.8,10.2 | v17.72,8.44 17.49,8.21 17.38,8.21 17.07,7.89 U9.24
  Bottom 0.152: v17.72,8.44 17.69,8.46 17.69,9.41 16.9,10.2 v16.8,10.2
RX  (via drill 0.2)
  Top 0.15: U5.4 7.75,35.01 U14.5 U14.6
  Top 0.152: U1.16 25.38,19.52 25.71,19.85 25.71,22.68 25.49,22.89 25.49,23.52 24.02,25 v24,25 | v19.2,30.8 19.62,31.22 U$1.10 | U14.6 9.53,34.97 v9.7,34.8
  Bottom 0.152: v24,25 19.2,29.8 v19.2,30.8 19.2,31.4 15.8,34.8 v9.7,34.8
RXD  (via drill 0.2)
  Top 0.152: U9.26 16.07,8.55 v16.25,8.73 | v19.53,8.37 20.77,8.37 22.88,10.48 U1.40
  Bottom 0.152: v16.25,8.73 16.25,8.35 17.1,7.5 18.15,7.5 18.68,8.03 19.19,8.03 v19.53,8.37
RXD_LED
  Top 0.15: U9.18 19.82,5.3 D10.2
SCK  (via drill 0.2)
  Top 0.15: v25.2,20.3 25.2,19.84 24.88,19.52 U1.17 | X2.5 25.72,7 25.39,7 U2.2 U2.9
  Bottom 0.127: 26.34,6.37 X2.5
  Bottom 0.15: v25.2,20.3 25.2,20.81 23.73,22.28 19.83,22.28 17.68,20.13 17.68,19.66 16.42,18.39 16.42,13.13 21.14,8.4 21.14,4.09 23.66,1.58 25.49,1.58 26.86,2.94 26.86,3.74 27.3,4.19 27.3,5.4 | 27.3,5.4 27.3,5.41 | 27.3,5.4 26.34,6.37
SCL  (via drill 0.2)
  Top 0.15: 16.78,19.6 17.54,18.84 U27.1 17.54,18.06 18.37,18.06 v18.4,18.09 | 16,14.4 16.1,14.5 v18.2,14.5
  Top 0.152: 17.36,12.95 16.41,11.99 15.99,11.99 15.59,12.39 15.59,13.13 R3.1 15.78,14.17 U10.6 16,14.4 | 16.78,19.6 16.29,20.09 16.29,22.01 15.65,22.65 15.04,22.65 14.75,22.36 U8.7 | U1.36 19.31,13.2 19.06,12.95 17.36,12.95 | 17.36,12.95
  Bottom 0.15: v18.2,14.5 17.89,14.8 17.89,17.59 v18.4,18.09
SDA  (via drill 0.2)
  Top 0.15: 16,17 16.33,17 17.38,15.95 U27.4 17.47,15.88 17.47,15.76 17.69,15.54 18.66,15.54 v19.1,15.1 | 16.11,19.88 16.11,18.21 R2.1
  Top 0.152: U1.39 22.38,11.08 v22.3,11 | 16,17 U10.1 15.81,17.05 R2.1 | U8.6 15.34,22.16 16.01,21.49 16.01,19.97 16.11,19.88
  Bottom 0.152: v19.1,15.1 19.1,14.62 19.11,14.61 19.11,14.19 19.1,14.18 19.1,13.26 20.67,11.69 20.67,11.68 21.35,11 v22.3,11
SDI  (via drill 0.2)
  Top 0.15: v22.8,20.2 22.88,20.12 U1.21 | X2.6 24.9,6.05 24.9,6.79 U2.1 U2.10
  Bottom 0.15: X2.6 25.8,5.15 25.8,4.12 24.34,2.66 23.75,2.66 22.08,4.34 22.08,8.65 17.25,13.47 17.25,14.52 17.25,18.05 18.52,19.31 18.52,19.79 19.7,20.98 21.61,20.98 21.94,20.65 22.35,20.65 v22.8,20.2
SO  (via drill 0.2)
  Top 0.15: v18.23,13.73 18.3,13.79 18.71,13.79 19.11,14.2 U1.34
  Top 0.152: v23.6,6.1 23.6,5.93 22.08,4.41 22.08,3.62 23.81,1.89 25.31,1.89 27.31,3.89 27.31,4.21 29.8,6.7 31.05,6.7 X1.2
  Bottom 0.15: 23.6,8.11 18.23,13.47 v18.23,13.73
  Bottom 0.152: v23.6,6.1 23.6,8.11
SRX  (via drill 0.2)
  Top 0.152: v19.16,9.04 19.58,9.04 19.91,8.71 20.71,8.71 21.79,9.79 21.79,11.21 21.88,11.3 U1.38
  Bottom 0.152: X1.4 30.5,3.72 30.5,2.8 28.7,1 23.4,1 20.5,3.9 20.5,8.12 19.74,8.88 19.33,8.88 v19.16,9.04
STX  (via drill 0.2)
  Top 0.152: v16.2,12.5 16.93,13.22 18.63,13.22 19.11,13.7 U1.35
  Bottom 0.152: X1.5 29.4,3.05 29.4,2.2 28.5,1.3 23.5,1.3 20.8,4 20.8,8.36 17.46,11.7 17.1,11.7 16.3,12.5 v16.2,12.5
SWDCLK  (via drill 0.2)
  Top 0.15: U5.8 6.2,33.01 7.43,31.77 U13.4 U13.7
  Top 0.152: U$1.25 26.79,29.79 v26.6,29.6 | v9.7,31.6 9.53,31.77 U13.7
  Bottom 0.152: v9.7,31.6 9.8,31.5 9.8,29.2 10.9,28.1 12.8,28.1 16.96,23.93 25.07,23.93 26.6,25.47 v26.6,29.6
SWDIO  (via drill 0.2)
  Top 0.15: U5.9 6.2,32.5 7.43,31.27 U13.5 U13.6
  Top 0.152: U$1.26 27.28,30.82 27.5,30.6 27.5,29.77 v27.33,29.6 | U13.6 8.99,31.27 9.2,31.06 v9.2,30.5
  Bottom 0.152: v9.2,30.5 9.2,29.3 10.7,27.8 12.7,27.8 16.84,23.66 25.18,23.66 27.33,25.81 v27.33,29.6
SWO  (via drill 0.2)
  Top 0.15: U5.6 6.6,34 7.33,33.27 U13.1 U13.10
  Top 0.152: U13.10 8.94,33.52 v10.02,33.52 | v24.48,28.32 24.48,28.68 24.79,28.99 U$1.21
  Bottom 0.152: v10.02,33.52 10.7,32.84 10.7,29.5 11.4,28.8 13.3,28.8 17.61,24.49 24.83,24.49 25.24,24.9 25.24,24.94 25.6,25.3 25.6,26.69 24.9,27.39 24.89,27.39 24.49,27.79 24.49,28.31 v24.48,28.32
TX  (via drill 0.2)
  Top 0.15: U5.3 7.77,35.49 U14.4 U14.7
  Top 0.152: U$1.8 19.89,32.02 v19.6,31.73 | U14.7 9.53,35.47 v9.7,35.64 | U1.14 26.38,22.76 26.51,22.89 26.51,23.33 v24.73,25.11
  Bottom 0.152: v24.73,25.11 19.71,30.13 19.71,31.62 v19.6,31.73 15.69,35.64 v9.7,35.64
TXD  (via drill 0.2)
  Top 0.152: U9.25 16.57,8.18 v16.99,8.6 | v18.56,8.54 18.56,8.52 19.28,7.8 20.6,7.8 23.4,10.6 23.4,12.66 U1.41
  Bottom 0.152: v16.99,8.6 17.21,8.37 17.21,8.23 17.51,7.93 17.95,7.93 v18.56,8.54
TXD_LED
  Top 0.15: D6.2 20.11,6.05 19.86,5.8 U9.19
VBUS
  Top 0.305: J4.A4 7.25,7.85 7,7.6 J4.B9 5.4,7.6 5.1,7.3 5.1,5.3 5.3,5.1 J4.B4 7.1,5.1 7.35,4.85 J4.A9
  pour Top: 8.2,7.7 9.5,7.7 9.6,7.6 11.7,7.6 11.9,7.8 13.2,7.8 13.6,8.2 13.6,10.3 13.1,10.8 10.5,10.8 10.4,10.7 10.4,10.5 8.6,8.7 8.6,8.2 8.4,8 8.2,8
VDD  (via drill 0.2, 0.25, 0.3, 0.35)
  Top 0.152: U10.5 14.93,14.2 R3.2 14.4,13.31 13.94,13.31 C22.2 | R1.2 25.2,27.8 v25.1,27.9 | R15.2 29.98,18.07 v30.2,18.3 | U8.10 13.25,23.05 v13.3,23.1 | C20.2 27.83,12.33 28,12.5 | U1.3 U1.4 | R2.2 14.96,18.38 v15.24,18.66
  Top 0.2: U$1.13 21.59,28.82 C25.2 | C25.2 21.48,27.82 C21.2 | C25.2 v22.3,28.7 | 14.4,13.31 14.6,13.11 v14.6,12.4
  Top 0.203: U$1.48 21.28,35.93 v20.93,35.93 20.43,36.43 C14.2 | U$1.36 v26.79,35.79 v26.8,35.8 26.83,35.83 C6.2 | U1.43 24.38,11.92 v24.4,11.9 v24.39,11.89 C30.1 | C7.2 25.27,11.27 v25.9,11.9 25.9,12.66 U1.46 | U1.37 21.2,12.51 v21.2,11.9 C15.1 20.18,11.18 C33.1 | C17.1 28,12.5 v27.9,12.5 27.39,13.01 U1.1 | U1.4 28.11,14.7 v28.21,14.79 28.92,14.79 C12.1 | U1.19 23.88,19.88 v23.9,19.9 C13.1 | U27.9 19.88,16.95 C37.1 v20,17.8 | U27.9 U27.10 19.06,17.79 19.77,18.5 C36.1 | U27.9 U27.2
  Top 0.254: R22.1 16.59,1.8 v17.5,1.8 | R23.1 v20.2,2.9 | R11.1 20.02,7.4 v18.9,7.4 | U9.7 14.3,4.1 | 14.3,4.1 U9.6 13.8,4.3 | U5.2 6.7,36 7.17,36.47 U14.2 U14.9 9.07,36.47 v9.4,36.8 | C24.1 13.43,4.3 13.8,4.3 | 13.92,4.17 13.8,4.3 | U9.7 14.06,4.04 | 14.06,4.04 13.92,4.17 | C24.1 13.4,4.17 | 13.4,4.17 13.92,4.17 | U9.7 13.9,3.8 | 13.9,3.8 13.78,3.8 13.54,4.04 | 13.54,4.04 13.4,4.17 | C24.1 13.53,4.17 13.9,3.8 | 13.54,4.04 14.06,4.04 | 13.92,4.17 14.22,4.17 14.3,4.1 | v12.2,3.6 12.78,4.17 C24.1
  Top 0.305: D2.1 21.05,24.65 20.61,24.65 19.95,25.3 v19.9,25.3
  Top 0.508: Q5.2 19.95,23.7 19.95,25.3
  other vias: 14.1,32.1 14.7,31.6 15.5,31.6 16.3,31.6 17.1,31.6
  pour Top: 13.1,30.7 13.1,33.7 17.3,33.7 17.7,33.3 17.7,31.6 17.4,31.3 14.8,31.3 14.2,30.7
  pour Route15: 0.1,39.9 35,39.9 30.2,35.1 27,35.1 26.2,34.3 26.2,30.4 26.7,29.9 26.7,25 30.5,21.2 30.5,15.9 28.8,14.2 27.2,14.2 27,14 27,13.4 27.2,13.2 27.7,13.2 35,5.9 35,0 0,0 0,39.8